# Altium project EPS_V1.PrjPcb
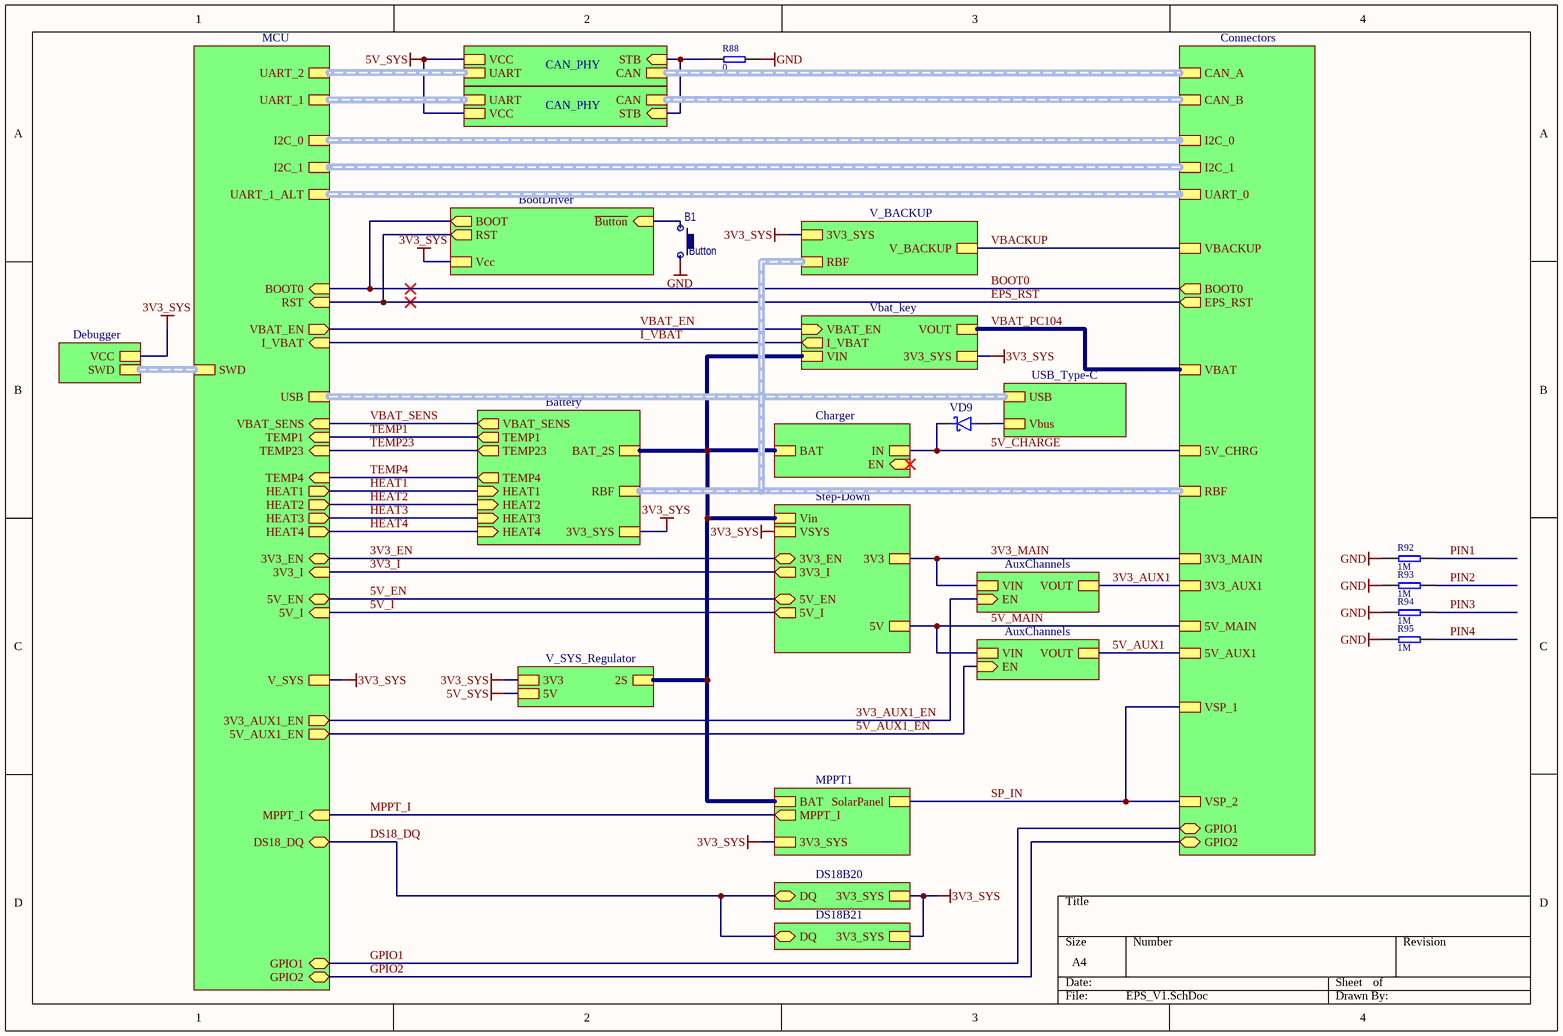
[diagram p0: EPS_V1.SchDoc]
21 sheets, 311 parts. Net scope: hierarchical (ports join the sheet entries above them; power ports are global).
Board file: EPS_V1.PcbDoc
Sheets:
  EPS_V1.SchDoc
    Battery = Battery.SchDoc
      Balancer = Balancer.SchDoc
      BAT3 = BMS.SchDoc
      BAT2 = BMS.SchDoc
      BAT4 = BMS.SchDoc
      BAT1 = BMS.SchDoc
      Balancer = Balancer.SchDoc
      Timer = Timer.SchDoc
    Step-Down = DC-step-down.SchDoc
      OverCurrent_Protection_1 = OverCurrent_Protection.SchDoc
      OverCurrent_Protection_2 = OverCurrent_Protection.SchDoc
    MPPT1 = MPPT.SchDoc
      ShuntAmp = ShuntAmp.SchDoc
    USB_Type-C = USB_Type-C.SchDoc
    Charger = Charger.SchDoc
    MCU = MCU.SchDoc
    Connectors = Connectors.SchDoc
    CAN_PHY = CAN_PHY.SchDoc
    CAN_PHY = CAN_PHY.SchDoc
    V_SYS_Regulator = V_SYS_Regulator.SchDoc
    Vbat_key = Vbat_key.SchDoc
      OverCurrent_Protection_3 = OverCurrent_Protection.SchDoc
    AuxChannels = AuxChannels.SchDoc
    AuxChannels = AuxChannels.SchDoc
    V_BACKUP = V_BACKUP.SchDoc
    DS18B20 = DS18B20.SchDoc
    DS18B21 = DS18B20.SchDoc
    BootDriver = BootDriver.SchDoc
    Debugger = Debugger.SchDoc

## Sheet EPS_V1.SchDoc
size A4; SheetNumber: 1; SheetTotal: 21

### Parts
B1  Button  [button]
R88  value 0  [RES 0402]
R92  value 1M  [RES 0402]
R93  value 1M  [RES 0402]
R94  value 1M  [RES 0402]
R95  value 1M  [RES 0402]
VD9  (no value)  [SOD-123]

### Sub-sheets
AuxChannels = AuxChannels.SchDoc: VIN, VOUT, EN (in)
AuxChannels = AuxChannels.SchDoc: VIN, VOUT, EN (in)
Battery = Battery.SchDoc: BAT_2S, VBAT_SENS (out), HEAT2 (in), 3V3_SYS, RBF (harness RBF), HEAT4 (in), TEMP23 (out), TEMP4 (out), HEAT3 (in), TEMP1 (out), HEAT1 (in)
BootDriver = BootDriver.SchDoc: ~{Button} (in), RST (out), BOOT (out), Vcc
CAN_PHY = CAN_PHY.SchDoc: VCC, STB (in), CAN (harness CAN), UART (harness UART)
CAN_PHY = CAN_PHY.SchDoc: VCC, STB (in), CAN (harness CAN), UART (harness UART)
Charger = Charger.SchDoc: BAT, IN, EN (in)
Connectors = Connectors.SchDoc: VSP_2, VSP_1, BOOT0 (out), EPS_RST (out), 5V_MAIN, VBAT, 3V3_MAIN, VBACKUP, I2C_1 (harness I2C), UART_0 (harness UART), I2C_0 (harness I2C), CAN_A (harness CAN), CAN_B (harness CAN), 5V_CHRG, RBF (harness RBF), 3V3_AUX1, 5V_AUX1, GPIO1 (bidir), GPIO2 (bidir)
Debugger = Debugger.SchDoc: SWD (harness SWD), VCC
DS18B20 = DS18B20.SchDoc: DQ (bidir), 3V3_SYS
DS18B21 = DS18B20.SchDoc: DQ (bidir), 3V3_SYS
MCU = MCU.SchDoc: SWD (harness SWD), BOOT0 (in), RST (in), 3V3_I (in), 5V_I (in), 3V3_EN (bidir), 5V_EN (bidir), VBAT_SENS (in), UART_2 (harness UART), I2C_1 (harness I2C), UART_1 (harness UART), I2C_0 (harness I2C), V_SYS, USB (harness USB), UART_1_ALT (harness UART), TEMP1 (in), TEMP23 (in), TEMP4 (in), HEAT1 (out), HEAT2 (out), HEAT3 (out), HEAT4 (out), VBAT_EN (out), I_VBAT (in), 3V3_AUX1_EN (out), 5V_AUX1_EN (out), MPPT_I (in), DS18_DQ (bidir), GPIO1 (bidir), GPIO2 (bidir)
MPPT1 = MPPT.SchDoc: SolarPanel, BAT, 3V3_SYS, MPPT_I (out)
Step-Down = DC-step-down.SchDoc: Vin, 3V3_EN (bidir), 3V3_I (out), VSYS, 3V3, 5V_I (out), 5V_EN (bidir), 5V
USB_Type-C = USB_Type-C.SchDoc: USB (harness USB), Vbus
V_BACKUP = V_BACKUP.SchDoc: V_BACKUP, RBF (harness RBF), 3V3_SYS
V_SYS_Regulator = V_SYS_Regulator.SchDoc: 2S, 3V3, 5V
Vbat_key = Vbat_key.SchDoc: VIN, VBAT_EN (in), VOUT, I_VBAT (out), 3V3_SYS

### Nets
3V3_SYS: sheet Battery/3V3_SYS, sheet Step-Down/VSYS, sheet MPPT1/3V3_SYS, sheet MCU/V_SYS, sheet V_SYS_Regulator/3V3, sheet Vbat_key/3V3_SYS, sheet V_BACKUP/3V3_SYS, sheet DS18B20/3V3_SYS, sheet DS18B21/3V3_SYS, sheet BootDriver/Vcc, sheet Debugger/VCC
5V_SYS: sheet CAN_PHY/VCC, sheet CAN_PHY/VCC, sheet V_SYS_Regulator/5V
BAT_2S: sheet Battery/BAT_2S, sheet Step-Down/Vin, sheet MPPT1/BAT, sheet Charger/BAT, sheet V_SYS_Regulator/2S, sheet Vbat_key/VIN
GND: B1.1 R88.2 R92.1 R93.1 R94.1 R95.1
3V3_AUX1: sheet Connectors/3V3_AUX1, sheet AuxChannels/VOUT
3V3_AUX1_EN: sheet MCU/3V3_AUX1_EN, sheet AuxChannels/EN
3V3_EN: sheet Step-Down/3V3_EN, sheet MCU/3V3_EN
3V3_I: sheet Step-Down/3V3_I, sheet MCU/3V3_I
3V3_MAIN: sheet Step-Down/3V3, sheet Connectors/3V3_MAIN, sheet AuxChannels/VIN
5V_AUX1: sheet Connectors/5V_AUX1, sheet AuxChannels/VOUT
5V_AUX1_EN: sheet MCU/5V_AUX1_EN, sheet AuxChannels/EN
5V_CHARGE: VD9.C(Cathode) ; sheet Charger/IN, sheet Connectors/5V_CHRG
5V_EN: sheet Step-Down/5V_EN, sheet MCU/5V_EN
5V_I: sheet Step-Down/5V_I, sheet MCU/5V_I
5V_MAIN: sheet Step-Down/5V, sheet Connectors/5V_MAIN, sheet AuxChannels/VIN
BOOT0: sheet MCU/BOOT0, sheet Connectors/BOOT0, sheet BootDriver/BOOT
DS18_DQ: sheet MCU/DS18_DQ, sheet DS18B20/DQ, sheet DS18B21/DQ
EPS_RST: sheet MCU/RST, sheet Connectors/EPS_RST, sheet BootDriver/RST
GPIO1: sheet MCU/GPIO1, sheet Connectors/GPIO1
GPIO2: sheet MCU/GPIO2, sheet Connectors/GPIO2
HEAT1: sheet Battery/HEAT1, sheet MCU/HEAT1
HEAT2: sheet Battery/HEAT2, sheet MCU/HEAT2
HEAT3: sheet Battery/HEAT3, sheet MCU/HEAT3
HEAT4: sheet Battery/HEAT4, sheet MCU/HEAT4
I_VBAT: sheet MCU/I_VBAT, sheet Vbat_key/I_VBAT
MPPT_I: sheet MPPT1/MPPT_I, sheet MCU/MPPT_I
PIN1: R92.2
PIN2: R93.2
PIN3: R94.2
PIN4: R95.2
SP_IN: sheet MPPT1/SolarPanel, sheet Connectors/VSP_2, sheet Connectors/VSP_1
TEMP1: sheet Battery/TEMP1, sheet MCU/TEMP1
TEMP4: sheet Battery/TEMP4, sheet MCU/TEMP4
TEMP23: sheet Battery/TEMP23, sheet MCU/TEMP23
VBACKUP: sheet Connectors/VBACKUP, sheet V_BACKUP/V_BACKUP
VBAT_EN: sheet MCU/VBAT_EN, sheet Vbat_key/VBAT_EN
VBAT_PC104: sheet Connectors/VBAT, sheet Vbat_key/VOUT
VBAT_SENS: sheet Battery/VBAT_SENS, sheet MCU/VBAT_SENS
NetB1_2: B1.2 ; sheet BootDriver/~{Button}
NetR88_1: R88.1 ; sheet CAN_PHY/STB, sheet CAN_PHY/STB
NetUSB1_A4B9: VD9.A(Anode) ; sheet USB_Type-C/Vbus

### Buses and harness runs
harness sheet Battery/RBF = sheet Connectors/RBF = sheet V_BACKUP/RBF
harness sheet CAN_PHY/CAN = sheet Connectors/CAN_A
harness sheet CAN_PHY/CAN = sheet Connectors/CAN_B
harness sheet CAN_PHY/UART = sheet MCU/UART_1
harness sheet CAN_PHY/UART = sheet MCU/UART_2
harness sheet Connectors/I2C_0 = sheet MCU/I2C_0
harness sheet Connectors/I2C_1 = sheet MCU/I2C_1
harness sheet Connectors/UART_0 = sheet MCU/UART_1_ALT
harness sheet Debugger/SWD = sheet MCU/SWD
harness sheet MCU/USB = sheet USB_Type-C/USB

### Library data of the parts
R88 R92-R95 = !Resistor: Resistor; IsSMT: NoSMT
VD9 = DiodeS: Diode Shottky; IsSMT: NoSMT

## Sheet Battery.SchDoc
size A4; SheetNumber: 2; SheetTotal: 21
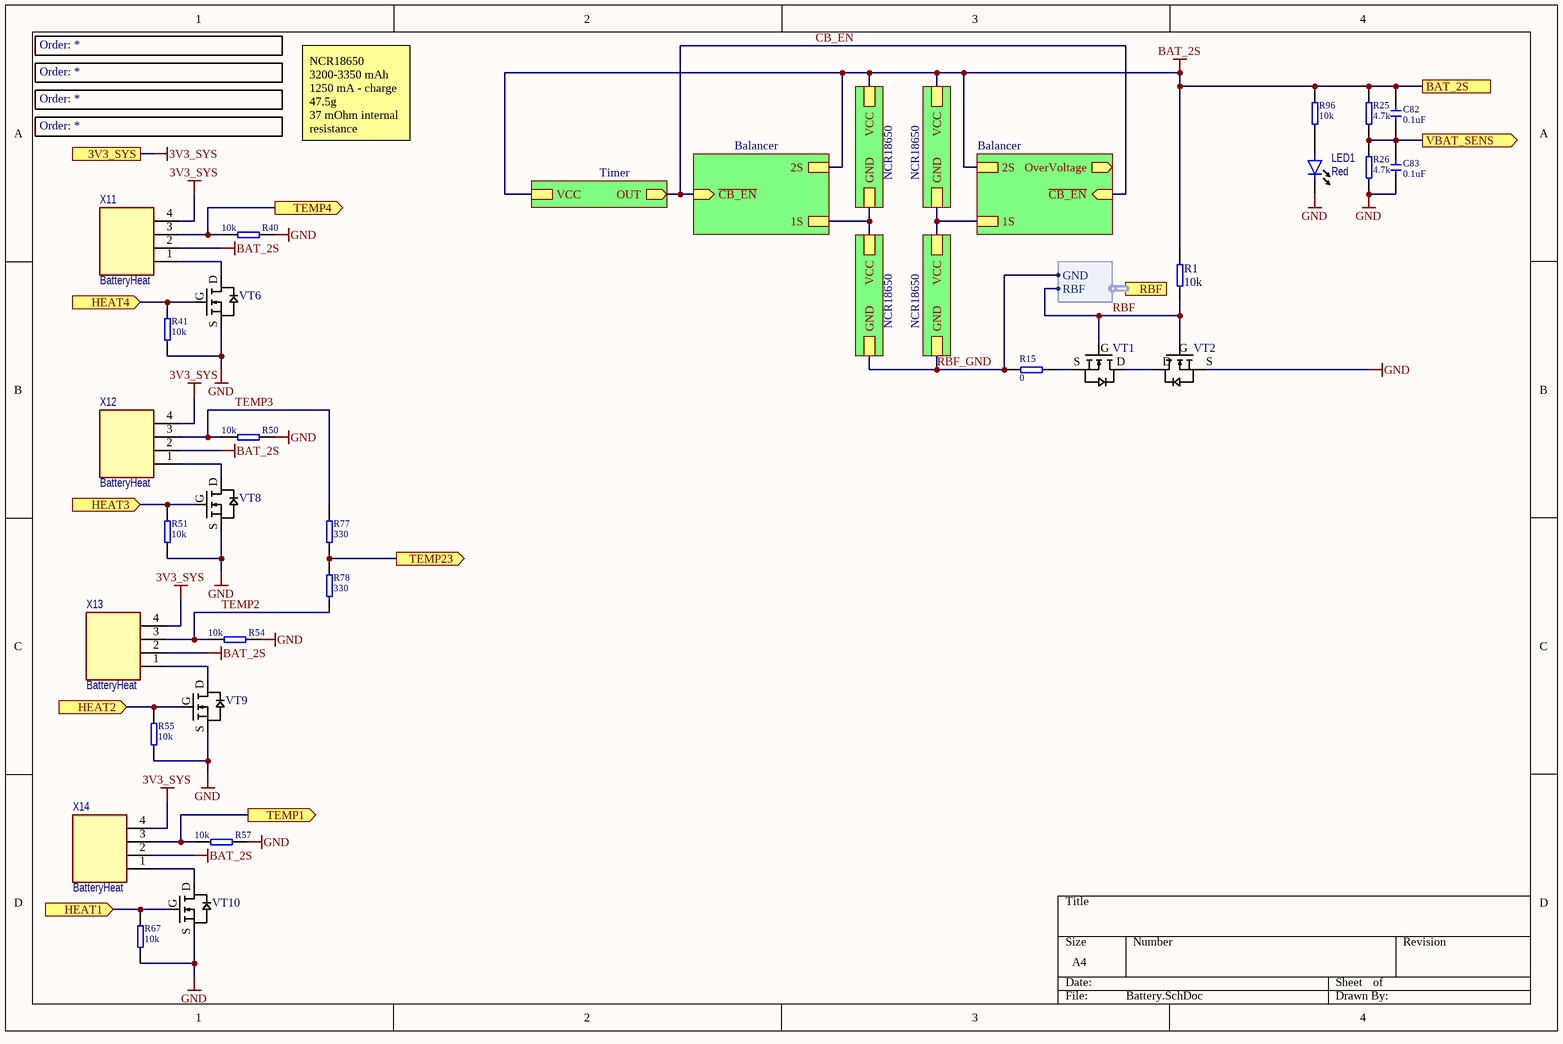
[diagram p1: Battery.SchDoc]

### Parts
Additional_order1  *  (mechanical)
Additional_order2  *  (mechanical)
Additional_order3  *  (mechanical)
Additional_order4  *  (mechanical)
C82  value 0.1uF  [CERCAP 0402]
C83  value 0.1uF  [CERCAP 0402]
LED1  value Red  [LED 0603]
R1  value 10k  [RES 0402]
R15  value 0  [RES 0805]
R25  value 4.7k  [RES 0402]
R26  value 4.7k  [RES 0402]
R40  value 10k  [RES 0402]
R41  value 10k  [RES 0402]
R50  value 10k  [RES 0402]
R51  value 10k  [RES 0402]
R54  value 10k  [RES 0402]
R55  value 10k  [RES 0402]
R57  value 10k  [RES 0402]
R67  value 10k  [RES 0402]
R77  value 330  [RES 0402]
R78  value 330  [RES 0402]
R96  value 10k  [RES 0402]
VT1  NTMFS5C670NLT1G  [DFN-8_3x3]  (value not drawn)
VT2  NTMFS5C670NLT1G  [DFN-8_3x3]  (value not drawn)
VT6  2N7002  [SOT23-3]  (value not drawn)
VT8  2N7002  [SOT23-3]  (value not drawn)
VT9  2N7002  [SOT23-3]  (value not drawn)
VT10  2N7002  [SOT23-3]  (value not drawn)
X11  Purpose: BatteryHeat  [PicoBlade_4P]  (hidden comment: 0533980471)
X12  Purpose: BatteryHeat  [PicoBlade_4P]  (hidden comment: 0533980471)
X13  Purpose: BatteryHeat  [PicoBlade_4P]  (hidden comment: 0533980471)
X14  Purpose: BatteryHeat  [PicoBlade_4P]  (hidden comment: 0533980471)

### Sub-sheets
Balancer = Balancer.SchDoc: 2S, ~{CB_EN} (in), 1S
Balancer = Balancer.SchDoc: OverVoltage (out), 2S, ~{CB_EN} (in), 1S
BAT1 = BMS.SchDoc: VCC, GND
BAT2 = BMS.SchDoc: VCC, GND
BAT3 = BMS.SchDoc: VCC, GND
BAT4 = BMS.SchDoc: VCC, GND
Timer = Timer.SchDoc: OUT (out), VCC

### Ports
3V3_SYS, BAT_2S, HEAT1 (in), HEAT2 (in), HEAT3 (in), HEAT4 (in), RBF (harness RBF), TEMP1 (out), TEMP4 (out), TEMP23 (out), VBAT_SENS (out)

### Harnesses
RBF: GND, RBF

### Nets
3V3_SYS: X11.4 X12.4 X13.4 X14.4 ; port 3V3_SYS
BAT_2S: C82.2 R1.2 R25.2 R96.2 X11.2 X12.2 X13.2 X14.2 ; port BAT_2S, sheet Balancer/2S, sheet BAT2/VCC, sheet BAT1/VCC, sheet Balancer/2S, sheet Timer/VCC
GND: C83.1 LED1.2(Cathode) R26.1 R40.2 R41.1 R50.2 R51.1 R54.2 R55.1 R57.2 R67.1 VT2.S1 VT6.S1 VT8.S1 VT9.S1 VT10.S1
CB_EN: sheet Balancer/~{CB_EN}, sheet Balancer/~{CB_EN}, sheet Timer/OUT
HEAT1: R67.2 VT10.G2 ; port HEAT1
HEAT2: R55.2 VT9.G2 ; port HEAT2
HEAT3: R51.2 VT8.G2 ; port HEAT3
HEAT4: R41.2 VT6.G2 ; port HEAT4
RBF: R1.1 VT1.G2 VT2.G2 ; port RBF.RBF
RBF_GND: R15.1 ; sheet BAT3/GND, sheet BAT4/GND, port RBF.GND
TEMP1: R57.1 X14.3 ; port TEMP1
TEMP2: R54.1 R78.1 X13.3
TEMP3: R50.1 R77.2 X12.3
TEMP4: R40.1 X11.3 ; port TEMP4
TEMP23: R77.1 R78.2 ; port TEMP23
VBAT_SENS: C82.1 C83.2 R25.1 R26.2 ; port VBAT_SENS
NetBAT1_BAT3_A: sheet Balancer/1S, sheet BAT3/VCC, sheet BAT1/GND
NetBAT1_BAT4_A: sheet BAT2/GND, sheet BAT4/VCC, sheet Balancer/1S
NetLED1_1: LED1.1(Anode) R96.1
NetR15_2: R15.2 VT1.S1
NetVT1_D6: VT1.D6 VT2.D6
NetVT6_D6: VT6.D6 X11.1
NetVT8_D6: VT8.D6 X12.1
NetVT9_D6: VT9.D6 X13.1
NetVT10_D6: VT10.D6 X14.1

### Notes on the sheet
- NCR18650
  3200-3350 mAh
  1250 mA - charge
  47.5g
  37 mOhm internal resistance
- NCR18650
- (in symbol !Generic N MOSFET) G; S; D

### Library data of the parts
Additional_order1-Additional_order4 = Additional_Order: Order: *
C82 C83 = !Capacitor: Capacitor; IsSMT: NoSMT; Voltage: 50V; Diel: X7R
LED1 = LED: Light Emittering Diode; IsSMT: NoSMT
R1 R15 R25 R26 R40 R41 R50 R51 R54 R55 R57 R67 R77 R78 R96 = !Resistor: Resistor; IsSMT: NoSMT
VT1 VT2 = !Generic N MOSFET: generic N mosfet; pin to pad: D6>5+6+7+8+TH G2>4 S1>1+2+3; IsSMT: NoSMT
VT6 VT8-VT10 = !Generic N MOSFET: generic N mosfet; pin to pad: D6>3 G2>1 S1>2; IsSMT: NoSMT
X11-X14 = Header 1x4: 4x1 header; IsSMT: NoSMT

## Sheet Balancer.SchDoc
size A4; SheetNumber: 4; SheetTotal: 21
Used 2 times, as channels Battery/Balancer, Battery/Balancer. Parts and nets are listed once, with the designators drawn on the sheet.
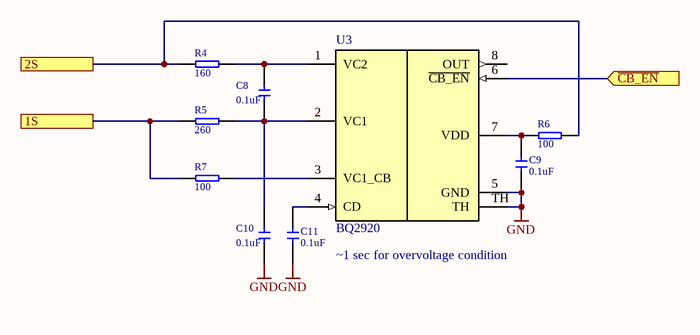
[diagram p2: Balancer.SchDoc]

### Parts
C8  value 0.1uF  [CERCAP 0402]
C9  value 0.1uF  [CERCAP 0402]
C10  value 0.1uF  [CERCAP 0402]
C11  value 0.1uF  [CERCAP 0402]
R4  value 160  [RES 0603]
R5  value 260  [RES 0603]
R6  value 100  [RES 0402]
R7  value 100  [RES 0603]
U3  BQ2920  [VSON-8]

### Ports
1S, 2S, ~{CB_EN} (in)

### Nets
GND: C9.1 C10.1 C11.1 U3.5(GND) U3.TH
1S: R5.1 R7.1 ; port 1S
2S: R4.1 R6.2 ; port 2S
~{CB_EN}: U3.6(~{CB_EN}) ; port ~{CB_EN}
NetC8_1: C8.1 C10.2 R5.2 U3.2(VC1)
NetC8_2: C8.2 R4.2 U3.1(VC2)
NetC9_2: C9.2 R6.1 U3.7(VDD)
NetC11_2: C11.2 U3.4(CD)
NetR7_2: R7.2 U3.3(VC1_CB)

Not connected (* = marked no-connect by the designer): U3 8(OUT)

### Channels
Battery/Balancer: designators end in _Battery_Balancer#1; ports 1S=NetBAT1_BAT3_A 2S=BAT_2S ~{CB_EN}=CB_EN
Battery/Balancer: designators end in _Battery_Balancer#2; ports 1S=NetBAT1_BAT4_A 2S=BAT_2S ~{CB_EN}=CB_EN

### Notes on the sheet
- ~1 sec for overvoltage condition

### Library data of the parts
C8-C11 = !Capacitor: as C82 on sheet Battery
R4-R7 = !Resistor: Resistor; IsSMT: NoSMT
U3 = BQ2920: 2S li-ion balancer

## Sheet BMS.SchDoc
size A4; SheetNumber: 3; SheetTotal: 21
Used 4 times, as channels Battery/BAT3, Battery/BAT2, Battery/BAT4, Battery/BAT1. Parts and nets are listed once, with the designators drawn on the sheet.
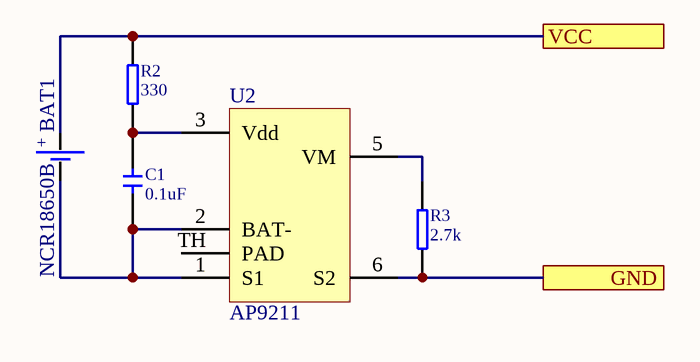
[diagram p3: BMS.SchDoc]

### Parts
BAT1  NCR18650B  [BAT_18650_CLIPS]
C1  value 0.1uF  [CERCAP 0402]
R2  value 330  [RES 0402]
R3  value 2.7k  [RES 0402]
U2  AP9211  [DFN-8-2x3]

### Ports
GND, VCC

### Nets
GND: R3.1 U2.6(S2) ; port GND
VCC: BAT1.A R2.2 ; port VCC
NetBAT1_K: BAT1.K C1.1 U2.1(S1) U2.2(BAT-)
NetC1_2: C1.2 R2.1 U2.3(Vdd)
NetR3_2: R3.2 U2.5(VM)

Not connected (* = marked no-connect by the designer): U2 TH(PAD)

### Channels
Battery/BAT3: designators end in _BAT3; ports GND=RBF_GND VCC=NetBAT1_BAT3_A
Battery/BAT2: designators end in _BAT2; ports GND=NetBAT1_BAT4_A VCC=BAT_2S
Battery/BAT4: designators end in _BAT4; ports GND=RBF_GND VCC=NetBAT1_BAT4_A
Battery/BAT1: designators end in _BAT1; ports GND=NetBAT1_BAT3_A VCC=BAT_2S

### Notes on the sheet
- (in symbol !Battery) +

### Library data of the parts
BAT1 = !Battery: generic battery
C1 = !Capacitor: as C82 on sheet Battery
R2 R3 = !Resistor: Resistor; IsSMT: NoSMT
U2 = AP9211: BMS with built-in keys; IsSMT: NoSMT; Order: *; LCSC Part #: *; BuyLink1: *

## Sheet Timer.SchDoc
size A4; SheetNumber: 5; SheetTotal: 21
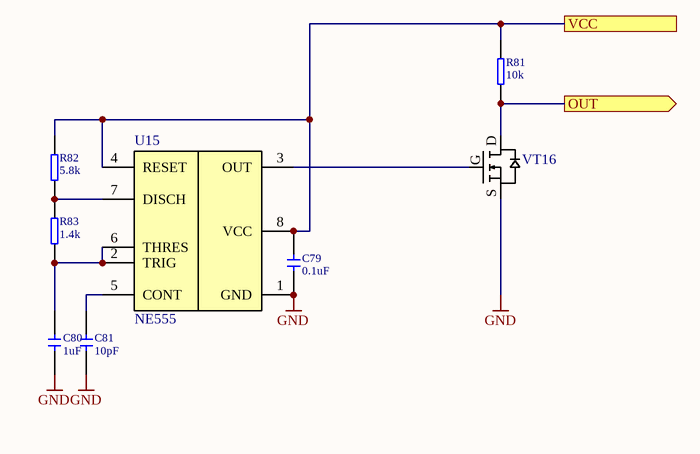
[diagram p4: Timer.SchDoc]

### Parts
C79  value 0.1uF  [CERCAP 0402]
C80  value 1uF  [CERCAP 0603]
C81  value 10pF  [CERCAP 0402]
R81  value 10k  [RES 0402]
R82  value 5.8k  [RES 0402]
R83  value 1.4k  [RES 0402]
U15  NE555  [SO-8]
VT16  2N7002  [SOT23-3]  (value not drawn)

### Ports
OUT (out), VCC

### Nets
BAT_2S: C79.2 R81.2 R82.2 U15.4(RESET) U15.8(VCC) ; port VCC
GND: C79.1 C80.1 C81.1 U15.1(GND) VT16.S1
CB_EN: R81.1 VT16.D6 ; port OUT
NetC80_2: C80.2 R83.1 U15.2(TRIG) U15.6(THRES)
NetC81_2: C81.2 U15.5(CONT)
NetR82_1: R82.1 R83.2 U15.7(DISCH)
NetU15_3: U15.3(OUT) VT16.G2

### Notes on the sheet
- (in symbol !Generic N MOSFET) D; G; S

### Library data of the parts
C79-C81 = !Capacitor: as C82 on sheet Battery
R81-R83 = !Resistor: Resistor; IsSMT: NoSMT
U15 = NE555: 555 timer
VT16 = !Generic N MOSFET: generic N mosfet; pin to pad: D6>3 G2>1 S1>2; IsSMT: NoSMT

## Sheet DC-step-down.SchDoc
size A4; SheetNumber: 7; SheetTotal: 21
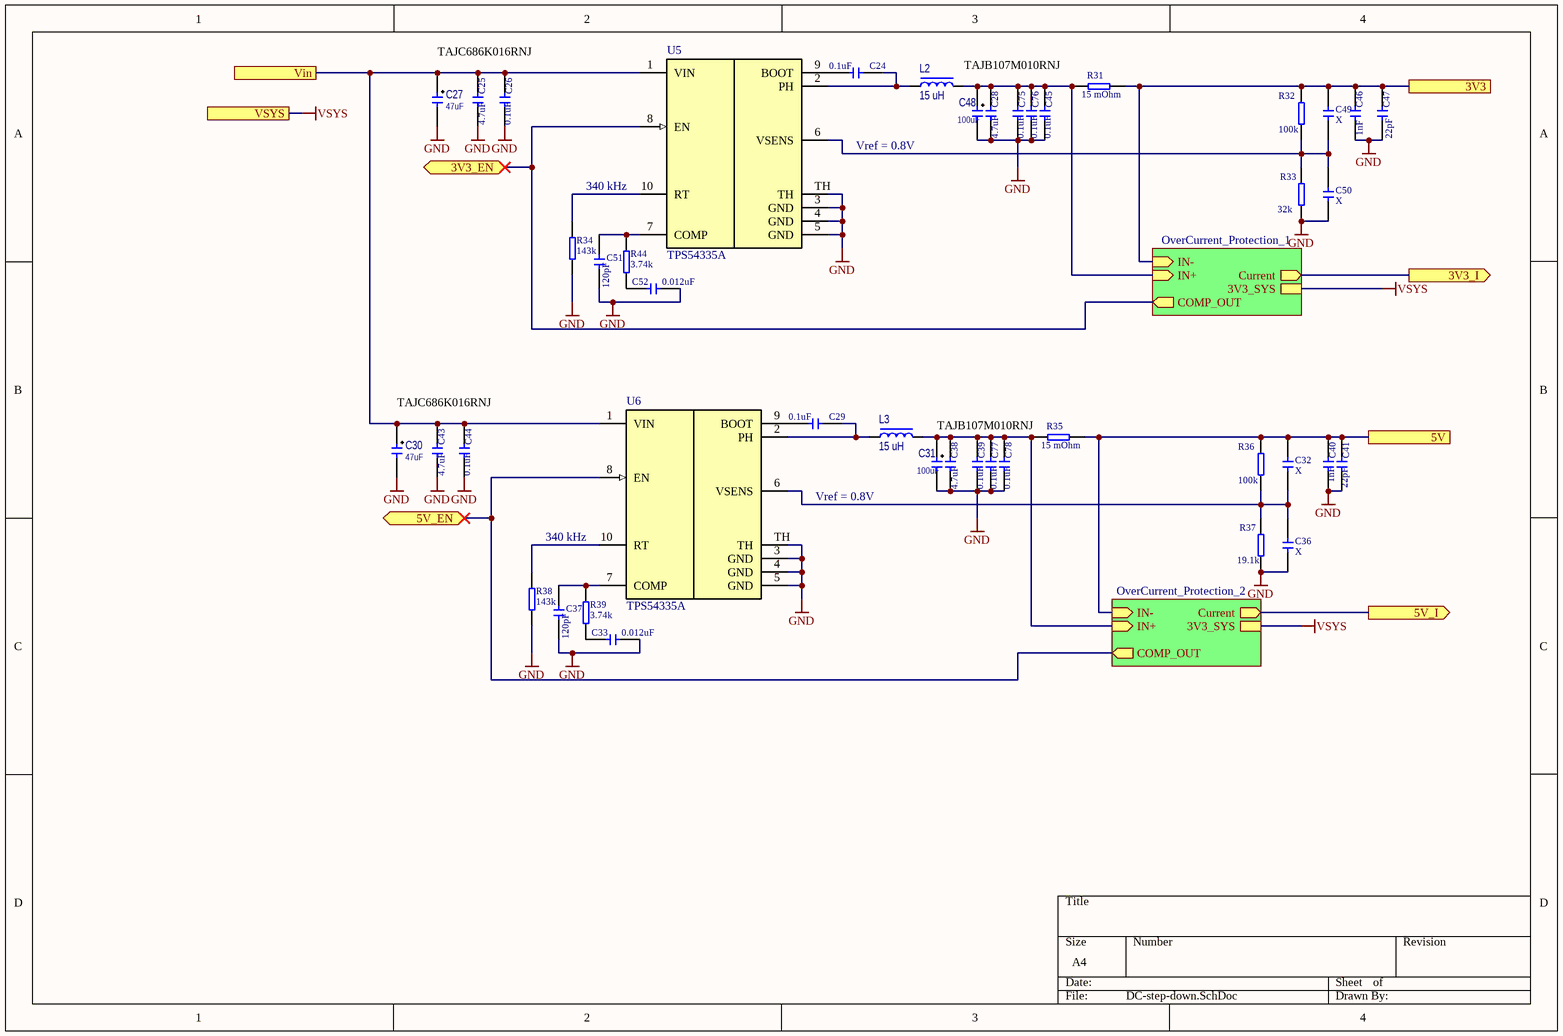
[diagram p5: DC-step-down.SchDoc]

### Parts
C24  value 0.1uF  [CERCAP 0402]
C25  value 4.7uF  [CERCAP 0603]
C26  value 0.1uF  [CERCAP 0402]
C27  value 47uF  [TECAP B]  (hidden comment: TAJC686K016RNJ)
C28  value 4.7uF  [CERCAP 0603]
C29  value 0.1uF  [CERCAP 0402]
C30  value 47uF  [TECAP B]  (hidden comment: TAJC686K016RNJ)
C31  value 100uF  [TECAP B]  (hidden comment: TAJB107M010RNJ)
C32  value X  [CERCAP 0402]  (no BOM)
C33  value 0.012uF  [CERCAP 0402]
C36  value X  [CERCAP 0402]  (no BOM)
C37  value 120pF  [CERCAP 0402]
C38  value 4.7uF  [CERCAP 0603]
C39  value 0.1uF  [CERCAP 0402]
C40  value 1nF  [CERCAP 0402]
C41  value 22pF  [CERCAP 0402]
C43  value 4.7uF  [CERCAP 0603]
C44  value 0.1uF  [CERCAP 0402]
C45  value 0.1uF  [CERCAP 0402]
C46  value 1nF  [CERCAP 0402]
C47  value 22pF  [CERCAP 0402]
C48  value 100uF  [TECAP B]  (hidden comment: TAJB107M010RNJ)
C49  value X  [CERCAP 0402]  (no BOM)
C50  value X  [CERCAP 0402]  (no BOM)
C51  value 120pF  [CERCAP 0402]
C52  value 0.012uF  [CERCAP 0402]
C75  value 0.1uF  [CERCAP 0402]
C76  value 0.1uF  [CERCAP 0402]
C77  value 0.1uF  [CERCAP 0402]
C78  value 0.1uF  [CERCAP 0402]
L2  value 15 uH  [IND-5x5]  (hidden comment: IND-5x5 15 uH)
L3  value 15 uH  [IND-5x5]  (hidden comment: IND-5x5 15 uH)
R31  value 15 mOhm  [RES 1210]
R32  value 100k  [RES 0402]
R33  value 32k  [RES 0402]
R34  value 143k  [RES 0402]
R35  value 15 mOhm  [RES 1210]
R36  value 100k  [RES 0402]
R37  value 19.1k  [RES 0402]
R38  value 143k  [RES 0402]
R39  value 3.74k  [RES 0402]
R44  value 3.74k  [RES 0402]
U5  TPS54335A  [VSON-10]
U6  TPS54335A  [VSON-10]

### Sub-sheets
OverCurrent_Protection_1 = OverCurrent_Protection.SchDoc: IN- (in), IN+ (in), Current (out), COMP_OUT (out), 3V3_SYS
OverCurrent_Protection_2 = OverCurrent_Protection.SchDoc: IN- (in), IN+ (in), Current (out), COMP_OUT (out), 3V3_SYS

### Ports
3V3, 3V3_EN (bidir), 3V3_I (out), 5V, 5V_EN (bidir), 5V_I (out), Vin, VSYS

### Nets
BAT_2S: C25.2 C26.2 C27.1(+) C30.1(+) C43.2 C44.2 U5.1(VIN) U6.1(VIN) ; port Vin
GND: C25.1 C26.1 C27.2(-) C28.1 C30.2(-) C31.2(-) C33.1 C36.1 C37.2 C38.1 C39.1 C40.1 C41.1 C43.1 C44.1 C45.1 C46.1 C47.1 C48.2(-) C50.1 C51.2 C52.1 C75.1 C76.1 C77.1 C78.1 R33.1 R34.1 R37.1 R38.1 U5.3(GND) U5.4(GND) U5.5(GND) U5.TH U6.3(GND) U6.4(GND) U6.5(GND) U6.TH
VSYS: port VSYS, sheet OverCurrent_Protection_1/3V3_SYS, sheet OverCurrent_Protection_2/3V3_SYS  [project net 3V3_SYS]
3V3_EN: U5.8(EN) ; port 3V3_EN, sheet OverCurrent_Protection_1/COMP_OUT
3V3_I: port 3V3_I, sheet OverCurrent_Protection_1/Current
3V3_MAIN: C46.2 C47.2 C49.2 R31.2 R32.2 ; port 3V3, sheet OverCurrent_Protection_1/IN-
5V_EN: U6.8(EN) ; port 5V_EN, sheet OverCurrent_Protection_2/COMP_OUT
5V_I: port 5V_I, sheet OverCurrent_Protection_2/Current
5V_MAIN: C32.2 C40.2 C41.2 R35.2 R36.2 ; port 5V, sheet OverCurrent_Protection_2/IN-
NetC24_1: C24.1 U5.9(BOOT)
NetC24_2: C24.2 L2.1 U5.2(PH)
NetC28_2: C28.2 C45.2 C48.1(+) C75.2 C76.2 L2.2 R31.1 ; sheet OverCurrent_Protection_1/IN+
NetC29_1: C29.1 U6.9(BOOT)
NetC29_2: C29.2 L3.1 U6.2(PH)
NetC31_1: C31.1(+) C38.2 C39.2 C77.2 C78.2 L3.2 R35.1 ; sheet OverCurrent_Protection_2/IN+
NetC32_1: C32.1 C36.2 R36.1 R37.2 U6.6(VSENS)
NetC33_2: C33.2 R39.1
NetC37_1: C37.1 R39.2 U6.7(COMP)
NetC49_1: C49.1 C50.2 R32.1 R33.2 U5.6(VSENS)
NetC51_1: C51.1 R44.2 U5.7(COMP)
NetC52_2: C52.2 R44.1
NetR34_2: R34.2 U5.10(RT)
NetR38_2: R38.2 U6.10(RT)

### Notes on the sheet
- TAJC686K016RNJ
- TAJB107M010RNJ
- Vref = 0.8V
- 340 kHz
- (near R35) TAJB107M010RNJ

### Library data of the parts
C24 C26 C29 C32 C33 C36 C37 C39-C41 C44-C47 C49-C52 C75-C78 = !Capacitor: as C82 on sheet Battery
C25 C43 = !Capacitor: Capacitor; IsSMT: NoSMT; Voltage: 16V; Diel: X7R
C27 C30 C31 C48 = CapacitorP: Capacitor Polar; IsSMT: NoSMT; Diel: X7R; Voltage: *
C28 C38 = !Capacitor: Capacitor; IsSMT: NoSMT; Voltage: 10V; Diel: X7R
L2 L3 = Inductor: IsSMT: NoSMT
R31-R39 R44 = !Resistor: Resistor; IsSMT: NoSMT
U5 U6 = TPS54335A: buck sync wEN woPG

## Sheet OverCurrent_Protection.SchDoc
size A4; SheetNumber: 8; SheetTotal: 21
Used 3 times, as channels Step-Down/OverCurrent_Protection_1, Step-Down/OverCurrent_Protection_2, Vbat_key/OverCurrent_Protection_3. Parts and nets are listed once, with the designators drawn on the sheet.
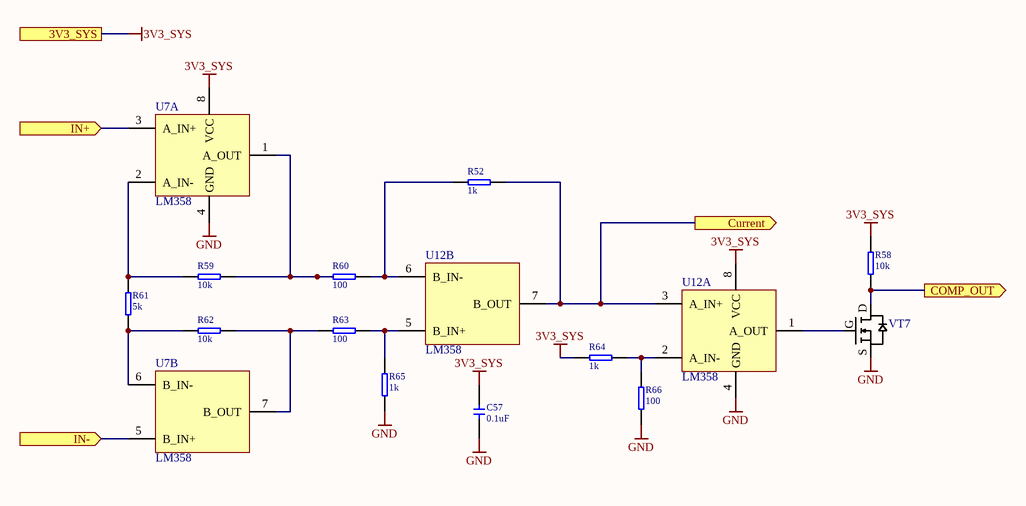
[diagram p6: OverCurrent_Protection.SchDoc]

### Parts
C57  value 0.1uF  [CERCAP 0402]
R52  value 1k  [RES 0402]
R58  value 10k  [RES 0402]
R59  value 10k  [RES 0402]
R60  value 100  [RES 0402]
R61  value 5k  [RES 0402]
R62  value 10k  [RES 0402]
R63  value 100  [RES 0402]
R64  value 1k  [RES 0402]
R65  value 1k  [RES 0402]
R66  value 100  [RES 0402]
U7  LM358  [DFN-8-2x2]  (parts A,B of 2)
U12  LM358  [DFN-8-2x2]  (parts A,B of 2)
VT7  2N7002  [SOT23-3]  (value not drawn)

### Ports
3V3_SYS, COMP_OUT (out), Current (out), IN+ (in), IN- (in)

### Nets
3V3_SYS: C57.2 R58.2 R64.2 U7.8(VCC) U12.8(VCC) ; port 3V3_SYS
GND: C57.1 R65.1 R66.2 U7.4(GND) U12.4(GND) VT7.S1
COMP_OUT: R58.1 VT7.D6 ; port COMP_OUT
Current: R52.1 U12.3(A_IN+) U12.7(B_OUT) ; port Current
IN+: U7.3(A_IN+) ; port IN+
IN-: U7.5(B_IN+) ; port IN-
NetR52_2: R52.2 R60.2 U12.6(B_IN-)
NetR59_1: R59.1 R61.2 U7.2(A_IN-)
NetR59_2: R59.2 R60.1 U7.1(A_OUT)
NetR61_1: R61.1 R62.1 U7.6(B_IN-)
NetR62_2: R62.2 R63.1 U7.7(B_OUT)
NetR63_2: R63.2 R65.2 U12.5(B_IN+)
NetR64_1: R64.1 R66.1 U12.2(A_IN-)
NetU12_1: U12.1(A_OUT) VT7.G2

### Channels
Step-Down/OverCurrent_Protection_1: designators end in _OverCurrent_Protection_1; ports 3V3_SYS=3V3_SYS COMP_OUT=3V3_EN Current=3V3_I IN+=NetC28_2 IN-=3V3_MAIN
Step-Down/OverCurrent_Protection_2: designators end in _OverCurrent_Protection_2; ports 3V3_SYS=3V3_SYS COMP_OUT=5V_EN Current=5V_I IN+=NetC31_1 IN-=5V_MAIN
Vbat_key/OverCurrent_Protection_3: designators end in _OverCurrent_Protection_3; ports 3V3_SYS=3V3_SYS COMP_OUT=VBAT_EN Current=I_VBAT IN+=NetR10_1 IN-=VBAT_PC104

### Notes on the sheet
- (in symbol !Generic N MOSFET) D; G; S

### Library data of the parts
C57 = !Capacitor: as C82 on sheet Battery
R52 R58-R66 = !Resistor: Resistor; IsSMT: NoSMT
U7 U12 = DualOpAmp: Operational amplifier
VT7 = !Generic N MOSFET: generic N mosfet; pin to pad: D6>3 G2>1 S1>2; IsSMT: NoSMT

## Sheet MPPT.SchDoc
size A4; SheetNumber: 9; SheetTotal: 21
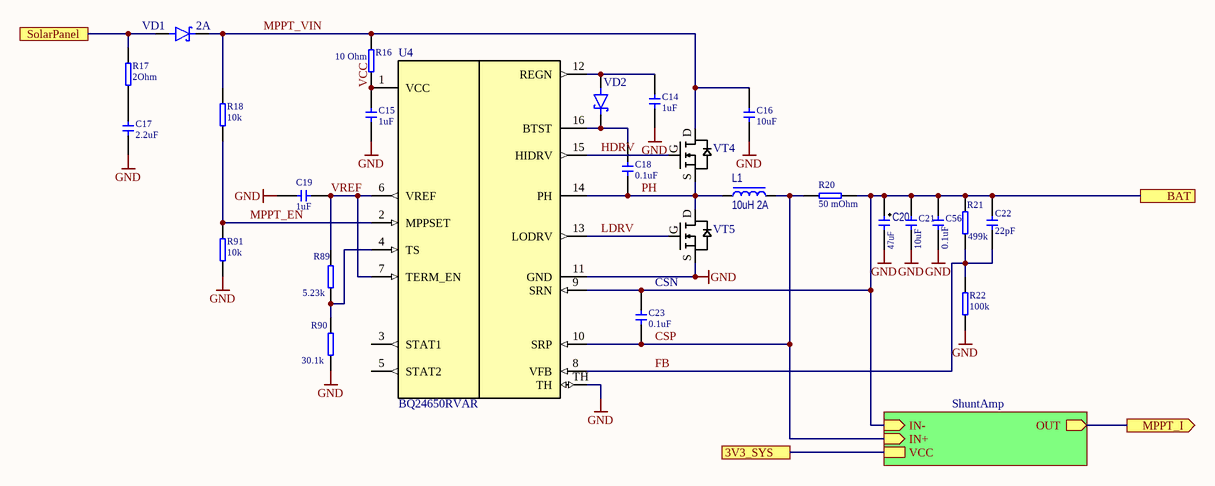
[diagram p7: MPPT.SchDoc]

### Parts
C14  value 1uF  [CERCAP 0402]
C15  value 1uF  [CERCAP 0402]
C16  value 10uF  [CERCAP 0603]
C17  value 2.2uF  [CERCAP 0603]
C18  value 0.1uF  [CERCAP 0402]
C19  value 1uF  [CERCAP 0402]
C20  value 47uF  [TECAP B]  (hidden comment: TAJC686K016RNJ)
C21  value 10uF  [CERCAP 0603]
C22  value 22pF  [CERCAP 0402]
C23  value 0.1uF  [CERCAP 0402]
C56  value 0.1uF  [CERCAP 0402]
L1  value 10uH 2A  [IND-4.6x4.6]
R16  value 10 Ohm  [RES 0402]
R17  value 2Ohm  [RES 0402]
R18  value 10k  [RES 0402]
R20  value 50 mOhm  [RES 1210]
R21  value 499k  [RES 0402]
R22  value 100k  [RES 0402]
R89  value 5.23k  [RES 0402]
R90  value 30.1k  [RES 0402]
R91  value 10k  [RES 0402]
U4  BQ24650RVAR  [QFN-16(3,5x3,5)]
VD1  (no value)  [SOD-123]
VD2  (no value)  [SOD-123]
VT4  NTMFS5C670NLT1G  [DFN-8_3x3]  (value not drawn)
VT5  NTMFS5C670NLT1G  [DFN-8_3x3]  (value not drawn)

### Sub-sheets
ShuntAmp = ShuntAmp.SchDoc: OUT (out), IN- (in), IN+ (in), VCC

### Ports
3V3_SYS, BAT, MPPT_I (out), SolarPanel

### Nets
3V3_SYS: port 3V3_SYS, sheet ShuntAmp/VCC
BAT_2S: C20.1(+) C21.2 C22.2 C23.2 C56.2 R20.2 R21.2 U4.9(SRN) ; port BAT, sheet ShuntAmp/IN-
GND: C14.1 C15.1 C16.2 C17.1 C19.2 C20.2(-) C21.1 C56.1 R22.1 R90.1 R91.1 U4.11(GND) U4.TH VT5.S1
CSP: C23.1 L1.2 R20.1 U4.10(SRP) ; sheet ShuntAmp/IN+
FB: C22.1 R21.1 R22.2 U4.8(VFB)
HDRV: U4.15(HIDRV) VT4.G2
LDRV: U4.13(LODRV) VT5.G2
MPPT_EN: R18.1 R91.2 U4.2(MPPSET)
MPPT_I: port MPPT_I, sheet ShuntAmp/OUT
MPPT_VIN: C16.1 R16.2 R18.2 VD1.C(Cathode) VT4.D6
PH: C18.1 L1.1 U4.14(PH) VT4.S1 VT5.D6
SP_IN: R17.2 VD1.A(Anode) ; port SolarPanel
VCC: C15.2 R16.1 U4.1(VCC)
VREF: C19.1 R89.2 U4.6(VREF) U4.7(TERM_EN)
NetC14_2: C14.2 U4.12(REGN) VD2.A(Anode)
NetC17_2: C17.2 R17.1
NetC18_2: C18.2 U4.16(BTST) VD2.C(Cathode)
NetR89_1: R89.1 R90.2 U4.4(TS)

Not connected (* = marked no-connect by the designer): U4 3(STAT1) 5(STAT2)

### Notes on the sheet
- (near VD1) 2A
- CSN
- (in symbol !Generic N MOSFET) D; G; S

### Library data of the parts
C14-C19 C21-C23 C56 = !Capacitor: as C82 on sheet Battery
C20 = CapacitorP: Capacitor Polar; IsSMT: NoSMT; Diel: X7R; Voltage: *
L1 = Inductor: IsSMT: NoSMT
R16-R18 R20-R22 R89-R91 = !Resistor: Resistor; IsSMT: NoSMT
U4 = BQ24650RVAR: MPPT charger
VD1 VD2 = DiodeS: Diode Shottky; IsSMT: NoSMT
VT4 VT5 = !Generic N MOSFET: generic N mosfet; pin to pad: D6>5+6+7+8+TH G2>4 S1>1+2+3; IsSMT: NoSMT

## Sheet ShuntAmp.SchDoc
size A4; SheetNumber: 10; SheetTotal: 21
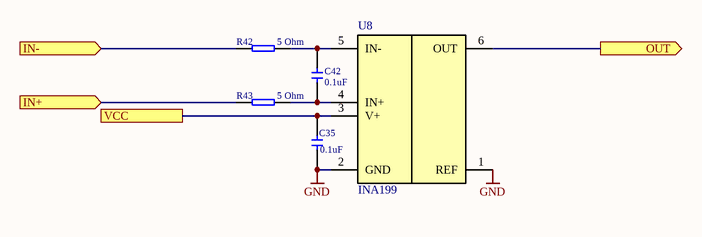
[diagram p8: ShuntAmp.SchDoc]

### Parts
C35  value 0.1uF  [CERCAP 0402]
C42  value 0.1uF  [CERCAP 0402]
R42  value 5 Ohm  [RES 0402]
R43  value 5 Ohm  [RES 0402]
U8  INA199  [SOT-323-6 (SC-70)]

### Ports
IN+ (in), IN- (in), OUT (out), VCC

### Nets
3V3_SYS: C35.2 U8.3(V+) ; port VCC
BAT_2S: R42.1 ; port IN-
GND: C35.1 U8.1(REF) U8.2(GND)
CSP: R43.1 ; port IN+
MPPT_I: U8.6(OUT) ; port OUT
NetC42_1: C42.1 R43.2 U8.4(IN+)
NetC42_2: C42.2 R42.2 U8.5(IN-)

### Library data of the parts
C35 C42 = !Capacitor: as C82 on sheet Battery
R42 R43 = !Resistor: Resistor; IsSMT: NoSMT
U8 = INA199: Current shunt monitor; IsSMT: NoSMT

## Sheet USB_Type-C.SchDoc
size A4; SheetNumber: 10; SheetTotal: 12
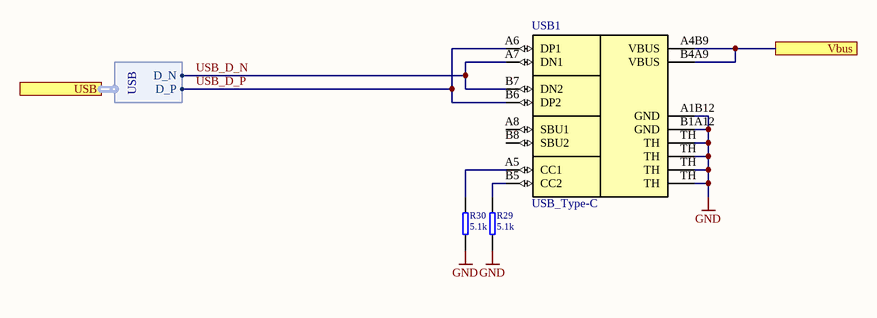
[diagram p9: USB_Type-C.SchDoc]

### Parts
R29  value 5.1k  [RES 0402]
R30  value 5.1k  [RES 0402]
USB1  USB_Type-C  [USB_Type-C]

### Ports
USB (harness USB), Vbus

### Harnesses
USB: D_N, D_P

### Nets
GND: R29.1 R30.1 USB1.A1B12(GND) USB1.B1A12(GND) USB1.TH
USB_D_N: USB1.A7(DN1) USB1.B7(DN2) ; port USB.D_N
USB_D_P: USB1.A6(DP1) USB1.B6(DP2) ; port USB.D_P
NetR29_2: R29.2 USB1.B5(CC2)
NetR30_2: R30.2 USB1.A5(CC1)
NetUSB1_A4B9: USB1.A4B9(VBUS) USB1.B4A9(VBUS) ; port Vbus

Not connected (* = marked no-connect by the designer): USB1 A8(SBU1) B8(SBU2)

### Library data of the parts
R29 R30 = !Resistor: Resistor; IsSMT: NoSMT
USB1 = USB_Type-C: USB Type-C connector

## Sheet Charger.SchDoc
size A4; SheetNumber: 12; SheetTotal: 21
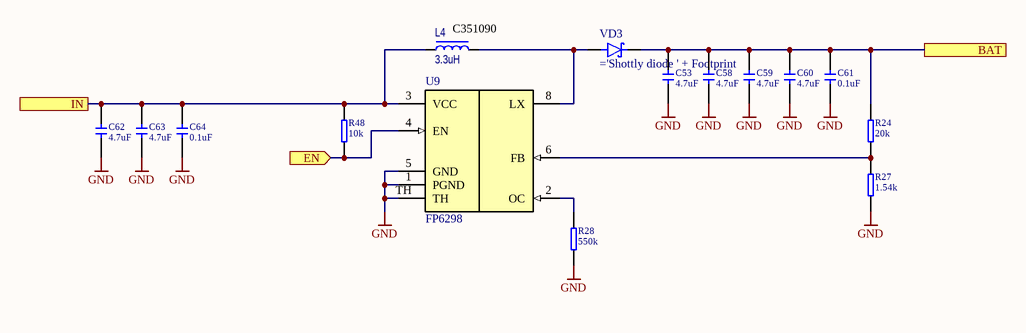
[diagram p10: Charger.SchDoc]

### Parts
C53  value 4.7uF  [CERCAP 0603]
C58  value 4.7uF  [CERCAP 0603]
C59  value 4.7uF  [CERCAP 0603]
C60  value 4.7uF  [CERCAP 0603]
C61  value 0.1uF  [CERCAP 0402]
C62  value 4.7uF  [CERCAP 0603]
C63  value 4.7uF  [CERCAP 0603]
C64  value 0.1uF  [CERCAP 0402]
L4  value 3.3uH  [IND-4.6x4.6]
R24  value 20k  [RES 0402]
R27  value 1.54k  [RES 0402]
R28  value 550k  [RES 0402]
R48  value 10k  [RES 0402]
U9  FP6298  [SO-8(EP)]
VD3  (no value)  [SOD-123]

### Ports
BAT, EN (in), IN

### Nets
BAT_2S: C53.2 C58.2 C59.2 C60.2 C61.2 R24.2 VD3.C(Cathode) ; port BAT
GND: C53.1 C58.1 C59.1 C60.1 C61.1 C62.1 C63.1 C64.1 R27.1 R28.1 U9.1(PGND) U9.5(GND) U9.TH
5V_CHARGE: C62.2 C63.2 C64.2 L4.1 R48.2 U9.3(VCC) ; port IN
NetL4_2: L4.2 U9.8(LX) VD3.A(Anode)
NetR24_1: R24.1 R27.2 U9.6(FB)
NetR28_2: R28.2 U9.2(OC)
NetR48_1: R48.1 U9.4(EN) ; port EN

### Notes on the sheet
- (near L4) C351090

### Library data of the parts
C53 C58-C60 = !Capacitor: as C25 on sheet DC-step-down
C61 C64 = !Capacitor: as C82 on sheet Battery
C62 C63 = !Capacitor: as C28 on sheet DC-step-down
L4 = Inductor: IsSMT: NoSMT
R24 R27 R28 R48 = !Resistor: Resistor; IsSMT: NoSMT
U9 = FP6298: boost not-synq wEN woPG wCL
VD3 = DiodeS: Diode Shottky; IsSMT: NoSMT

## Sheet MCU.SchDoc
size A4; SheetNumber: 5; SheetTotal: 9
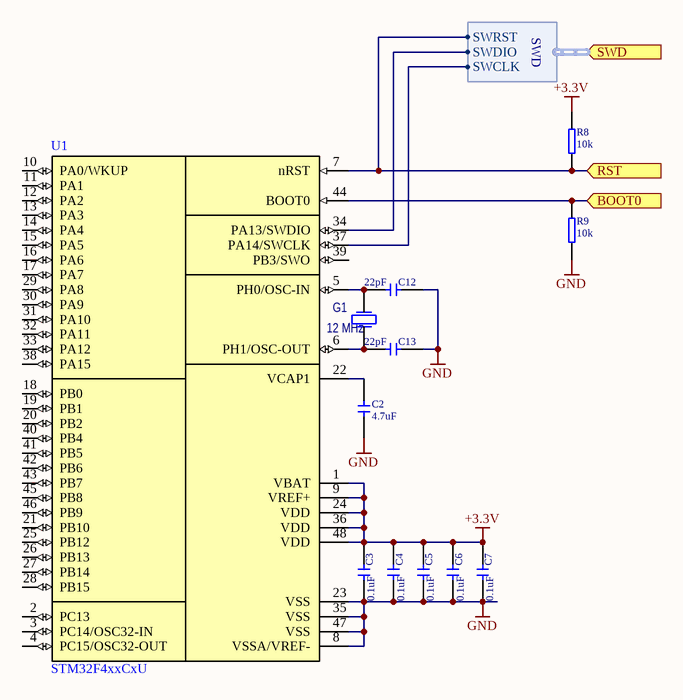
[diagram p11: MCU.SchDoc]

### Parts
C2  value 4.7uF  [CERCAP 0603]
C3  value 0.1uF  [CERCAP 0402]
C4  value 0.1uF  [CERCAP 0402]
C5  value 0.1uF  [CERCAP 0402]
C6  value 0.1uF  [CERCAP 0402]
C7  value 0.1uF  [CERCAP 0402]
C12  value 22pF  [CERCAP 0402]
C13  value 22pF  [CERCAP 0402]
G1  value 12 MHz  [3225]
R8  value 10k  [RES 0402]
R9  value 10k  [RES 0402]
U1  STM32F4xxCxU  [QFN-48]

### Ports
BOOT0 (in), RST (in), SWD (in, harness SWD)

### Harnesses
SWD: SWDIO, SWCLK, SWRST

### Nets
+3.3V: C3.2 C4.2 C5.2 C6.2 C7.2 R8.2 U1.1(VBAT) U1.9(VREF+) U1.24(VDD) U1.36(VDD) U1.48(VDD)
GND: C2.1 C3.1 C4.1 C5.1 C6.1 C7.1 C12.2 C13.2 R9.1 U1.8(VSSA/VREF-) U1.23(VSS) U1.35(VSS) U1.47(VSS)
BOOT0: R9.2 U1.44(BOOT0) ; port BOOT0
EPS_RST: R8.1 U1.7(nRST) ; port RST, port SWD.SWRST
NetC2_2: C2.2 U1.22(VCAP1)
NetC12_1: C12.1 G1.2 U1.5(PH0/OSC-IN)
NetC13_1: C13.1 G1.1 U1.6(PH1/OSC-OUT)
NetR85_2: U1.37(PA14/SWCLK) ; port SWD.SWCLK
NetR86_2: U1.34(PA13/SWDIO) ; port SWD.SWDIO

Not connected (* = marked no-connect by the designer): U1 2(PC13) 3(PC14/OSC32-IN) 4(PC15/OSC32-OUT) 10(PA0/WKUP) 11(PA1) 12(PA2) 13(PA3) 14(PA4) 15(PA5) 16(PA6) 17(PA7) 18(PB0) 19(PB1) 20(PB2) 21(PB10) 25(PB12) 26(PB13) 27(PB14) 28(PB15) 29(PA8) 30(PA9) 31(PA10) 32(PA11) 33(PA12) 38(PA15) 39(PB3/SWO) 40(PB4) 41(PB5) 42(PB6) 43(PB7) 45(PB8) 46(PB9)

### Library data of the parts
C2-C7 C12 C13 = !Capacitor: Capacitor; IsSMT: NoSMT; Diel: X7R; Voltage: *
G1 = Crystal: pin to pad: 2>3; IsSMT: NoSMT
R8 R9 = !Resistor: Resistor; IsSMT: NoSMT
U1 = STM32F4xxCxU: Cortex-M4

## Sheet Connectors.SchDoc
size A4; SheetNumber: 13; SheetTotal: 21
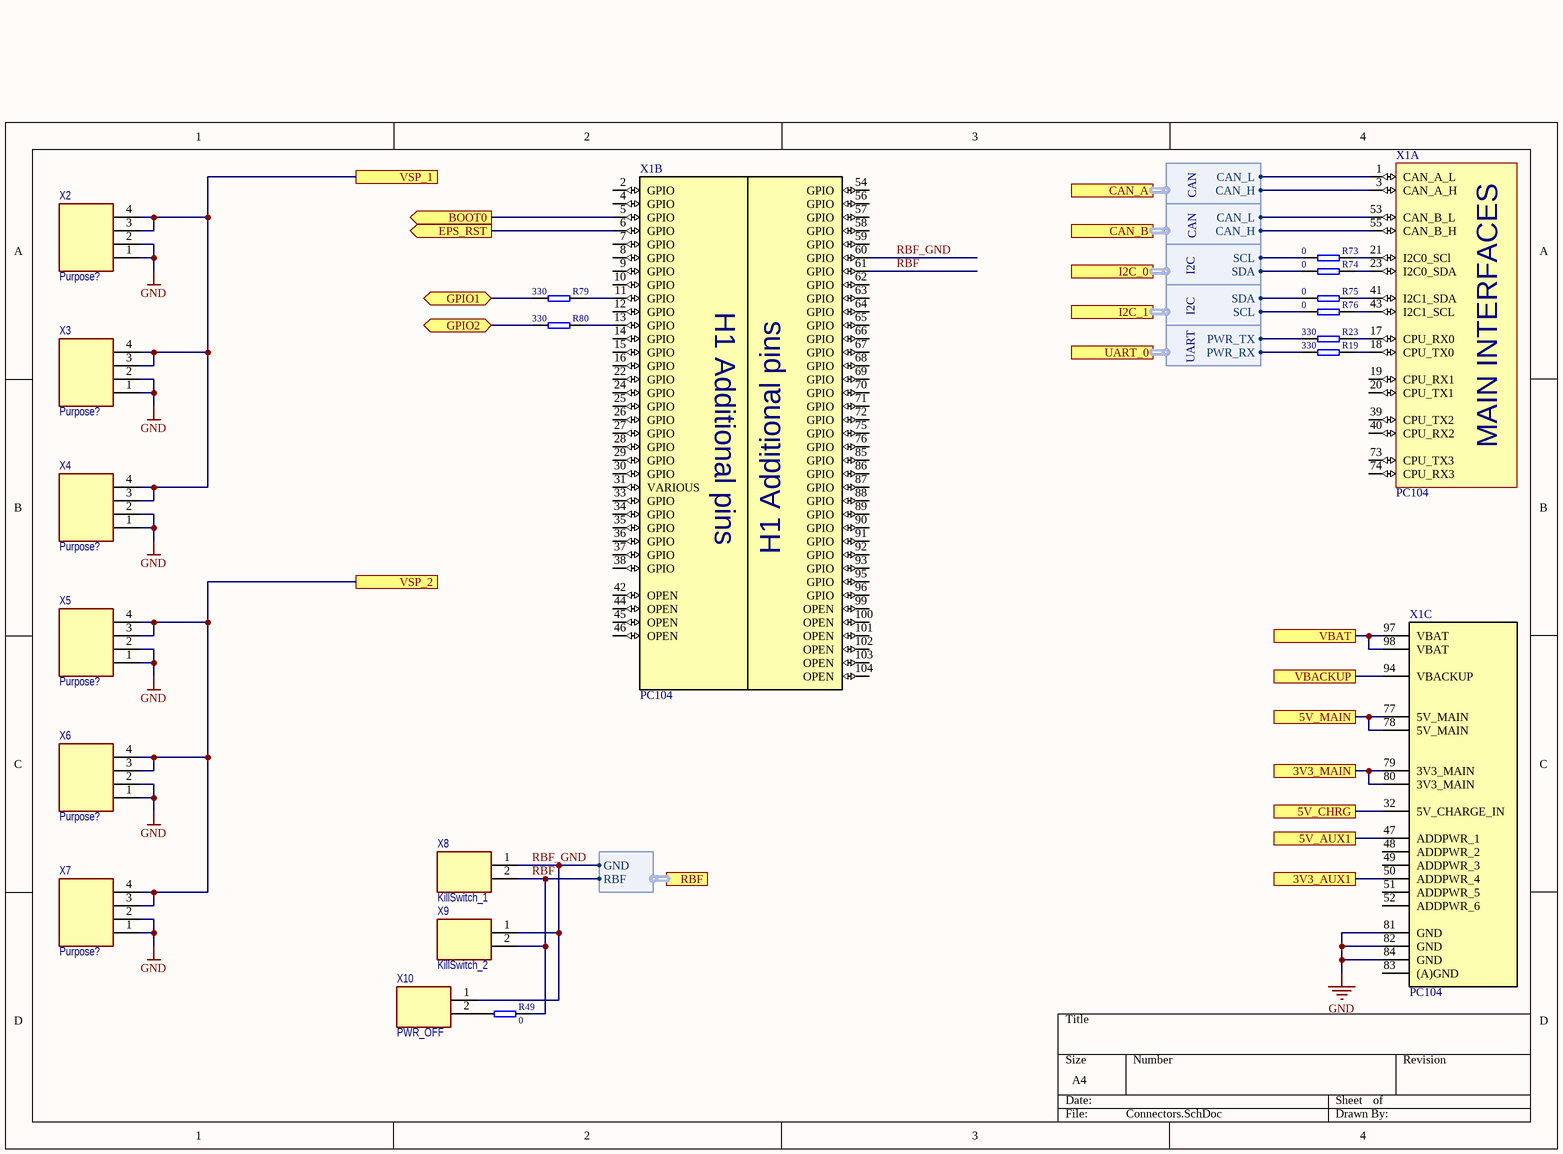
[diagram p12: Connectors.SchDoc]

### Parts
R19  value 330  [RES 0402]
R23  value 330  [RES 0402]
R49  value 0  [RES 0402]
R73  value 0  [RES 0402]
R74  value 0  [RES 0402]
R75  value 0  [RES 0402]
R76  value 0  [RES 0402]
R79  value 330  [RES 0402]
R80  value 330  [RES 0402]
X1  PC104  [PC104_ArianSpace]  (parts A,B,C of 3)
X2  Purpose: Purpose?  [PicoBlade_4P]  (hidden comment: 0533980471)
X3  Purpose: Purpose?  [PicoBlade_4P]  (hidden comment: 0533980471)
X4  Purpose: Purpose?  [PicoBlade_4P]  (hidden comment: 0533980471)
X5  Purpose: Purpose?  [PicoBlade_4P]  (hidden comment: 0533980471)
X6  Purpose: Purpose?  [PicoBlade_4P]  (hidden comment: 0533980471)
X7  Purpose: Purpose?  [PicoBlade_4P]  (hidden comment: 0533980471)
X8  Purpose: KillSwitch_1  [PicoBlade_2P]  (hidden comment: 0533980271)
X9  Purpose: KillSwitch_2  [PicoBlade_2P]  (hidden comment: 0533980271)
X10  Purpose: PWR_OFF  [PLS-2R-2.54]  (hidden comment: PLS-2R)

### Ports
3V3_AUX1, 3V3_MAIN, 5V_AUX1, 5V_CHRG, 5V_MAIN, BOOT0 (out), CAN_A (harness CAN), CAN_B (harness CAN), EPS_RST (out), GPIO1 (bidir), GPIO2 (bidir), I2C_0 (harness I2C), I2C_1 (harness I2C), RBF (harness RBF), UART_0 (harness UART), VBACKUP, VBAT, VSP_1, VSP_2

### Harnesses
CAN: CAN_H, CAN_L
I2C: SDA, SCL
UART: PWR_RX, PWR_TX
RBF: GND, RBF

### Nets
GND: X1.81(GND) X1.82(GND) X1.84(GND) X2.1 X2.2 X3.1 X3.2 X4.1 X4.2 X5.1 X5.2 X6.1 X6.2 X7.1 X7.2
3V3_AUX1: X1.50(ADDPWR_4) ; port 3V3_AUX1
3V3_MAIN: X1.79(3V3_MAIN) X1.80(3V3_MAIN) ; port 3V3_MAIN
5V_AUX1: X1.47(ADDPWR_1) ; port 5V_AUX1
5V_CHARGE: X1.32(5V_CHARGE_IN) ; port 5V_CHRG
5V_MAIN: X1.77(5V_MAIN) X1.78(5V_MAIN) ; port 5V_MAIN
BOOT0: X1.5(GPIO) ; port BOOT0
CAN_H: X1.3(CAN_A_H) ; port CAN_A.CAN_H
CAN_H: X1.55(CAN_B_H) ; port CAN_B.CAN_H  [a separate net that carries the same name]
CAN_L: X1.1(CAN_A_L) ; port CAN_A.CAN_L
CAN_L: X1.53(CAN_B_L) ; port CAN_B.CAN_L  [a separate net that carries the same name]
EPS_RST: X1.6(GPIO) ; port EPS_RST
GPIO1: R79.1 ; port GPIO1
GPIO2: R80.1 ; port GPIO2
RBF: R49.2 X1.61(GPIO) X8.2 X9.2 ; port RBF.RBF
RBF_GND: X1.60(GPIO) X8.1 X9.1 X10.1 ; port RBF.GND
SP_IN: X2.3 X2.4 X3.3 X3.4 X4.3 X4.4 X5.3 X5.4 X6.3 X6.4 X7.3 X7.4 ; port VSP_1, port VSP_2
VBACKUP: X1.94(VBACKUP) ; port VBACKUP
VBAT_PC104: X1.97(VBAT) X1.98(VBAT) ; port VBAT
NetR19_1: R19.1 ; port UART_0.PWR_RX
NetR19_2: R19.2 X1.18(CPU_TX0)
NetR23_1: R23.1 ; port UART_0.PWR_TX
NetR23_2: R23.2 X1.17(CPU_RX0)
NetR49_1: R49.1 X10.2
NetR73_1: R73.1 ; port I2C_0.SCL
NetR73_2: R73.2 X1.21(I2C0_SCl)
NetR74_1: R74.1 ; port I2C_0.SDA
NetR74_2: R74.2 X1.23(I2C0_SDA)
NetR75_1: R75.1 ; port I2C_1.SDA
NetR75_2: R75.2 X1.41(I2C1_SDA)
NetR76_1: R76.1 ; port I2C_1.SCL
NetR76_2: R76.2 X1.43(I2C1_SCL)
NetR79_2: R79.2 X1.11(GPIO)
NetR80_2: R80.2 X1.13(GPIO)

Not connected (* = marked no-connect by the designer): X1 2(GPIO) 4(GPIO) 7(GPIO) 8(GPIO) 9(GPIO) 10(GPIO) 12(GPIO) 14(GPIO) 15(GPIO) 16(GPIO) 19(CPU_RX1) 20(CPU_TX1) 22(GPIO) 24(GPIO) 25(GPIO) 26(GPIO) 27(GPIO) 28(GPIO) 29(GPIO) 30(GPIO) 31(VARIOUS) 33(GPIO) 34(GPIO) 35(GPIO) 36(GPIO) 37(GPIO) 38(GPIO) 39(CPU_TX2) 40(CPU_RX2) 42(OPEN) 44(OPEN) 45(OPEN) 46(OPEN) 48(ADDPWR_2) 49(ADDPWR_3) 51(ADDPWR_5) 52(ADDPWR_6) 54(GPIO) 56(GPIO) 57(GPIO) 58(GPIO) 59(GPIO) 62(GPIO) 63(GPIO) 64(GPIO) 65(GPIO) 66(GPIO) 67(GPIO) 68(GPIO) 69(GPIO) 70(GPIO) 71(GPIO) 72(GPIO) 73(CPU_TX3) 74(CPU_RX3) 75(GPIO) 76(GPIO) 83((A)GND) 85(GPIO) 86(GPIO) 87(GPIO) 88(GPIO) 89(GPIO) 90(GPIO) 91(GPIO) 92(GPIO) 93(GPIO) 95(GPIO) 96(GPIO) 99(OPEN) 100(OPEN) 101(OPEN) 102(OPEN) 103(OPEN) 104(OPEN)

### Notes on the sheet
- (in symbol PC104_ArianSpace, part A) MAIN INTERFACES
- (in symbol PC104_ArianSpace, part B) H1 Additional pins

### Library data of the parts
R19 R23 R49 R73-R76 R79 R80 = !Resistor: Resistor; IsSMT: NoSMT
X1 = PC104_ArianSpace: PC104 connector
X2-X7 = Header 1x4: 4x1 header; IsSMT: NoSMT
X8-X10 = Header 1x2: 2x1 header; isSMT: NoSMT

## Sheet CAN_PHY.SchDoc
size A4; SheetNumber: 14; SheetTotal: 21
Used 2 times, as channels CAN_PHY, CAN_PHY. Parts and nets are listed once, with the designators drawn on the sheet.
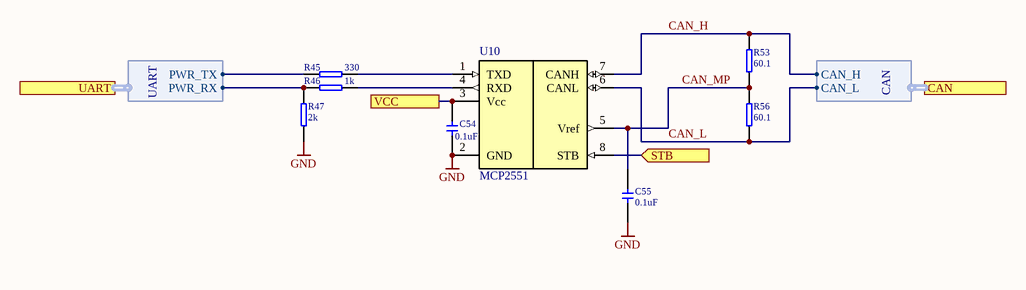
[diagram p13: CAN_PHY.SchDoc]

### Parts
C54  value 0.1uF  [CERCAP 0402]
C55  value 0.1uF  [CERCAP 0402]
R45  value 330  [RES 0402]
R46  value 1k  [RES 0402]
R47  value 2k  [RES 0402]
R53  value 60.1  [RES 0402]
R56  value 60.1  [RES 0402]
U10  MCP2551  [SO-8]

### Ports
CAN (harness CAN), STB (in), UART (harness UART), VCC

### Harnesses
CAN: CAN_H, CAN_L
UART: PWR_RX, PWR_TX

### Nets
GND: C54.1 C55.1 R47.1 U10.2(GND)
CAN_H: R53.2 U10.7(CANH) ; port CAN.CAN_H
CAN_L: R56.1 U10.6(CANL) ; port CAN.CAN_L
CAN_MP: C55.2 R53.1 R56.2 U10.5(Vref)
STB: U10.8(STB) ; port STB
VCC: C54.2 U10.3(Vcc) ; port VCC
NetR45_1: R45.1 ; port UART.PWR_TX
NetR45_2: R45.2 U10.1(TXD)
NetR46_1: R46.1 R47.2 ; port UART.PWR_RX
NetR46_2: R46.2 U10.4(RXD)

### Channels
CAN_PHY: designators end in _CAN_PHY#1; ports STB=NetR88_1 VCC=5V_SYS
CAN_PHY: designators end in _CAN_PHY#2; ports STB=NetR88_1 VCC=5V_SYS

### Library data of the parts
C54 C55 = !Capacitor: as C82 on sheet Battery
R45-R47 R53 R56 = !Resistor: Resistor; IsSMT: NoSMT
U10 = CAN_PHY: CAN PHY

## Sheet V_SYS_Regulator.SchDoc
size A4; SheetNumber: 15; SheetTotal: 21
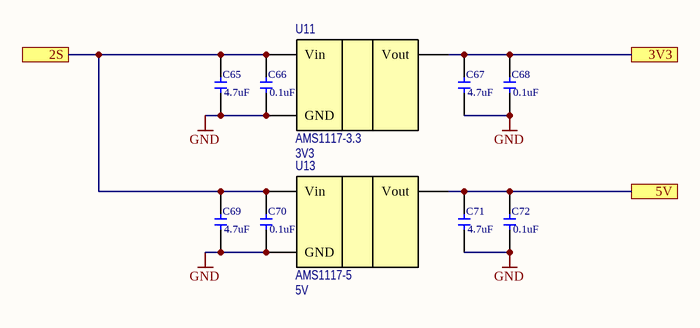
[diagram p14: V_SYS_Regulator.SchDoc]

### Parts
C65  value 4.7uF  [CERCAP 0603]
C66  value 0.1uF  [CERCAP 0402]
C67  value 4.7uF  [CERCAP 0603]
C68  value 0.1uF  [CERCAP 0402]
C69  value 4.7uF  [CERCAP 0603]
C70  value 0.1uF  [CERCAP 0402]
C71  value 4.7uF  [CERCAP 0603]
C72  value 0.1uF  [CERCAP 0402]
U11  AMS1117-3.3  value 3V3  [SOT223]
U13  AMS1117-5  value 5V  [SOT223]

### Ports
2S, 3V3, 5V

### Nets
3V3_SYS: C67.2 C68.2 U11.Vout ; port 3V3
5V_SYS: C71.2 C72.2 U13.Vout ; port 5V
BAT_2S: C65.2 C66.2 C69.2 C70.2 U11.Vin U13.Vin ; port 2S
GND: C65.1 C66.1 C67.1 C68.1 C69.1 C70.1 C71.1 C72.1 U11.ADJ/GND(GND) U13.ADJ/GND(GND)

### Library data of the parts
C65 C67 C69 C71 = !Capacitor: as C25 on sheet DC-step-down
C66 C68 C70 C72 = !Capacitor: as C82 on sheet Battery
U11 U13 = !Generic LDO: generic ldo; pin to pad: ADJ/GND>1 Vin>3 Vout>2; IsSMT: NoSMT

## Sheet Vbat_key.SchDoc
size A4; SheetNumber: 16; SheetTotal: 21
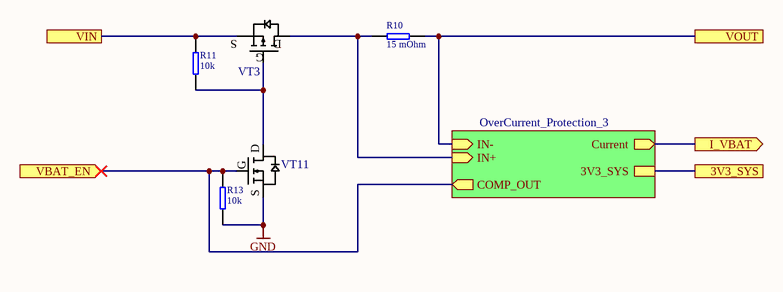
[diagram p15: Vbat_key.SchDoc]

### Parts
R10  value 15 mOhm  [RES 1210]
R11  value 10k  [RES 0402]
R13  value 10k  [RES 0402]
VT3  !Generic P MOSFET  [DFN-8_3x3]  (value not drawn)
VT11  2N7002  [SOT23-3]  (value not drawn)

### Sub-sheets
OverCurrent_Protection_3 = OverCurrent_Protection.SchDoc: IN- (in), IN+ (in), Current (out), COMP_OUT (out), 3V3_SYS

### Ports
3V3_SYS, I_VBAT (out), VBAT_EN (in), VIN, VOUT

### Nets
3V3_SYS: port 3V3_SYS, sheet OverCurrent_Protection_3/3V3_SYS
BAT_2S: R11.2 VT3.S1 ; port VIN
GND: R13.1 VT11.S1
I_VBAT: port I_VBAT, sheet OverCurrent_Protection_3/Current
VBAT_EN: R13.2 VT11.G2 ; port VBAT_EN, sheet OverCurrent_Protection_3/COMP_OUT
VBAT_PC104: R10.2 ; port VOUT, sheet OverCurrent_Protection_3/IN-
NetR10_1: R10.1 VT3.D1 ; sheet OverCurrent_Protection_3/IN+
NetR11_1: R11.1 VT3.G2 VT11.D6

### Notes on the sheet
- (in symbol !Generic N MOSFET) D; G; S
- (in symbol !Generic P MOSFET) S; D; G

### Library data of the parts
R10 R11 R13 = !Resistor: Resistor; IsSMT: NoSMT
VT3 = !Generic P MOSFET: generic P mosfet; pin to pad: D1>5+6+7+8+TH G2>4 S1>1+2+3; IsSMT: NoSMT
VT11 = !Generic N MOSFET: generic N mosfet; pin to pad: D6>3 G2>1 S1>2; IsSMT: NoSMT

## Sheet AuxChannels.SchDoc
size A4; SheetNumber: 17; SheetTotal: 17
Used 2 times, as channels AuxChannels, AuxChannels. Parts and nets are listed once, with the designators drawn on the sheet.
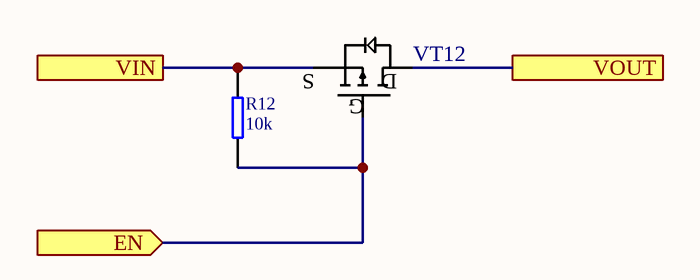
[diagram p16: AuxChannels.SchDoc]

### Parts
R12  value 10k  [RES 0402]
VT12  !Generic P MOSFET  [DFN-8_3x3]  (value not drawn)

### Ports
EN (in), VIN, VOUT

### Nets
EN: R12.1 VT12.G2 ; port EN
VIN: R12.2 VT12.S1 ; port VIN
VOUT: VT12.D1 ; port VOUT

### Channels
AuxChannels: designators end in _AuxChannels#1; ports EN=3V3_AUX1_EN VIN=3V3_MAIN VOUT=3V3_AUX1
AuxChannels: designators end in _AuxChannels#2; ports EN=5V_AUX1_EN VIN=5V_MAIN VOUT=5V_AUX1

### Notes on the sheet
- (in symbol !Generic P MOSFET) S; D; G

### Library data of the parts
R12 = !Resistor: Resistor; IsSMT: NoSMT
VT12 = !Generic P MOSFET: generic P mosfet; pin to pad: D1>5+6+7+8+TH G2>4 S1>1+2+3; IsSMT: NoSMT

## Sheet V_BACKUP.SchDoc
size A4; SheetNumber: 18; SheetTotal: 21
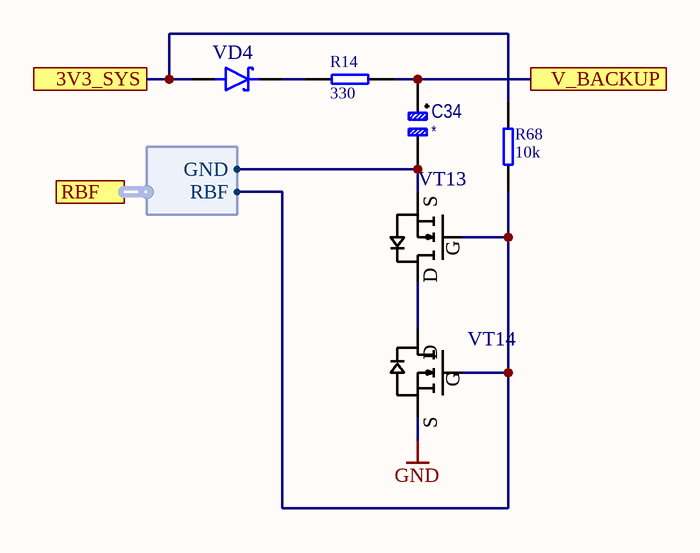
[diagram p17: V_BACKUP.SchDoc]

### Parts
C34  *  [DCS5R5224H]
R14  value 330  [RES 0402]
R68  value 10k  [RES 0402]
VD4  (no value)  [SOD-123]
VT13  2N7002  [SOT23-3]  (value not drawn)
VT14  2N7002  [SOT23-3]  (value not drawn)

### Ports
3V3_SYS, RBF (harness RBF), V_BACKUP

### Harnesses
RBF: GND, RBF

### Nets
3V3_SYS: R68.2 VD4.A(Anode) ; port 3V3_SYS
GND: VT14.S1
RBF: R68.1 VT13.G2 VT14.G2 ; port RBF.RBF
RBF_GND: C34.2(-) VT13.S1 ; port RBF.GND
VBACKUP: C34.1(+) R14.2 ; port V_BACKUP
NetR14_1: R14.1 VD4.C(Cathode)
NetVT13_D6: VT13.D6 VT14.D6

### Notes on the sheet
- (in symbol !Generic N MOSFET) D; G; S

### Library data of the parts
C34 = Ionistor: Super Capacitor; IsSMT: NoSMT; Order: *; LCSC Part #: *; BuyLink1: *; Value: *
R14 R68 = !Resistor: Resistor; IsSMT: NoSMT
VD4 = DiodeS: Diode Shottky; IsSMT: NoSMT
VT13 VT14 = !Generic N MOSFET: generic N mosfet; pin to pad: D6>3 G2>1 S1>2; IsSMT: NoSMT

## Sheet DS18B20.SchDoc
size A4; SheetNumber: 19; SheetTotal: 21
Used 2 times, as channels DS18B20, DS18B21. Parts and nets are listed once, with the designators drawn on the sheet.
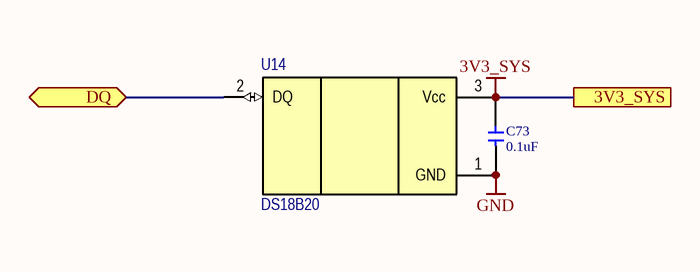
[diagram p18: DS18B20.SchDoc]

### Parts
C73  value 0.1uF  [CERCAP 0402]
U14  DS18B20  [TO-92]

### Ports
3V3_SYS, DQ (bidir)

### Nets
3V3_SYS: C73.2 U14.3(Vcc) ; port 3V3_SYS
GND: C73.1 U14.1(GND)
DQ: U14.2(DQ) ; port DQ

### Channels
DS18B20: designators end in _DS18B20; ports 3V3_SYS=3V3_SYS DQ=DS18_DQ
DS18B21: designators end in _DS18B21; ports 3V3_SYS=3V3_SYS DQ=DS18_DQ

### Library data of the parts
C73 = !Capacitor: as C82 on sheet Battery
U14 = DS18B20: Temp; IsSMT: NoSMT

## Sheet BootDriver.SchDoc
size A4; SheetNumber: 20; SheetTotal: 21
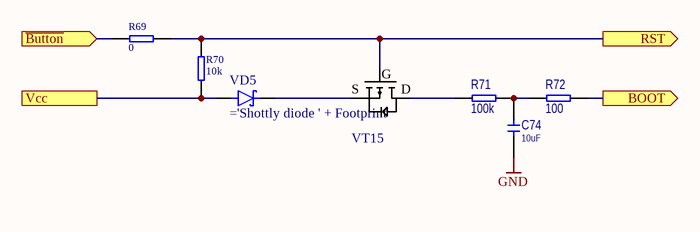
[diagram p19: BootDriver.SchDoc]

### Parts
C74  value 10uF  [CERCAP 0603]
R69  value 0  [RES 0402]
R70  value 10k  [RES 0402]
R71  value 100k  [RES 0402]
R72  value 100  [RES 0402]
VD5  (no value)  [SOD-123]
VT15  AO3407A  [SOT23-3]  (value not drawn)

### Ports
BOOT (out), RST (out), Vcc, ~{Button} (in)

### Nets
3V3_SYS: R70.1 VD5.A(Anode) ; port Vcc
GND: C74.1
BOOT0: R72.2 ; port BOOT
EPS_RST: R69.2 R70.2 VT15.G2 ; port RST
NetB1_2: R69.1 ; port ~{Button}
NetC74_2: C74.2 R71.2 R72.1
NetR71_1: R71.1 VT15.D1
NetVD5_C: VD5.C(Cathode) VT15.S1

### Notes on the sheet
- (in symbol !Generic P MOSFET) G; S; D

### Library data of the parts
C74 = !Capacitor: as C82 on sheet Battery
R69-R72 = !Resistor: Resistor; IsSMT: NoSMT
VD5 = DiodeS: Diode Shottky; IsSMT: NoSMT
VT15 = !Generic P MOSFET: generic P mosfet; pin to pad: D1>3 G2>1 S1>2; IsSMT: NoSMT

## Sheet Debugger.SchDoc
size A4; SheetNumber: 21; SheetTotal: 21
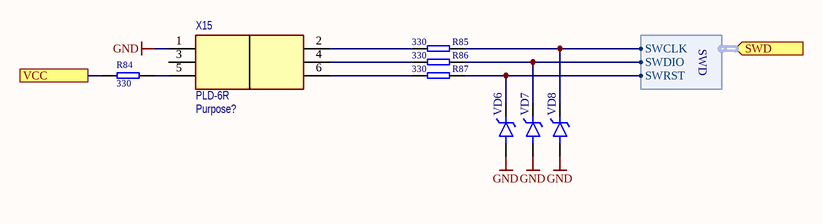
[diagram p20: Debugger.SchDoc]

### Parts
R84  value 330  [RES 0402]  (no BOM)
R85  value 330  [RES 0402]
R86  value 330  [RES 0402]
R87  value 330  [RES 0402]
VD6  DiodeTVSs  [SOD-323]  (value not drawn)
VD7  DiodeTVSs  [SOD-323]  (value not drawn)
VD8  DiodeTVSs  [SOD-323]  (value not drawn)
X15  PLD-6R  Purpose: Purpose?  [PBD-6-2.54]

### Ports
SWD (in, harness SWD), VCC

### Harnesses
SWD: SWDIO, SWCLK, SWRST

### Nets
3V3_SYS: R84.2 ; port VCC
GND: VD6.A(Anode) VD7.A(Anode) VD8.A(Anode) X15.1
EPS_RST: R87.2 VD6.C(Cathode) ; port SWD.SWRST
NetR84_1: R84.1 X15.5
NetR85_1: R85.1 X15.2
NetR85_2: R85.2 VD8.C(Cathode) ; port SWD.SWCLK
NetR86_1: R86.1 X15.4
NetR86_2: R86.2 VD7.C(Cathode) ; port SWD.SWDIO
NetR87_1: R87.1 X15.6

Not connected (* = marked no-connect by the designer): X15 3

### Library data of the parts
R84-R87 = !Resistor: Resistor; IsSMT: NoSMT
VD6-VD8 = DiodeTVSs: Diode TVS Single; IsSMT: NoSMT; Order: *; BuyLink1: *; LCSC Part #: *
X15 = Header 2x3: 3x2 header; IsSMT: NoSMT

## Nets that join several sheets
3V3_SYS: Battery (X11.4 X12.4 X13.4 X14.4), Step-Down/OverCurrent_Protection_1 (5 pins), Step-Down/OverCurrent_Protection_2 (5 pins), ShuntAmp (C35.2 U8.3), V_SYS_Regulator (C67.2 C68.2 U11.Vout), Vbat_key/OverCurrent_Protection_3 (5 pins), V_BACKUP (R68.2 VD4.A), DS18B20 (C73_DS18B20.2 U14_DS18B20.3), DS18B21 (C73_DS18B21.2 U14_DS18B21.3), BootDriver (R70.1 VD5.A), Debugger (R84.2)
5V_SYS: CAN_PHY (C54_CAN_PHY#1.2 U10_CAN_PHY#1.3), CAN_PHY (C54_CAN_PHY#2.2 U10_CAN_PHY#2.3), V_SYS_Regulator (C71.2 C72.2 U13.Vout)
BAT_2S: Battery (8 pins), Battery/Balancer (R4_Battery_Balancer#1.1 R6_Battery_Balancer#1.2), Battery/BAT2 (BAT1_BAT2.A R2_BAT2.2), Battery/BAT1 (BAT1_BAT1.A R2_BAT1.2), Battery/Balancer (R4_Battery_Balancer#2.1 R6_Battery_Balancer#2.2), Timer (5 pins), DC-step-down (8 pins), MPPT (8 pins), ShuntAmp (R42.1), Charger (7 pins), V_SYS_Regulator (6 pins), Vbat_key (R11.2 VT3.S1)
GND: EPS_V1 (6 pins), Battery (16 pins), Battery/Balancer (5 pins), Battery/Balancer (5 pins), Timer (5 pins), DC-step-down (38 pins), Step-Down/OverCurrent_Protection_1 (6 pins), Step-Down/OverCurrent_Protection_2 (6 pins), MPPT (14 pins), ShuntAmp (C35.1 U8.1 U8.2), USB_Type-C (5 pins), Charger (13 pins), MCU (13 pins), Connectors (15 pins), CAN_PHY (C54_CAN_PHY#1.1 C55_CAN_PHY#1.1 R47_CAN_PHY#1.1 U10_CAN_PHY#1.2), CAN_PHY (C54_CAN_PHY#2.1 C55_CAN_PHY#2.1 R47_CAN_PHY#2.1 U10_CAN_PHY#2.2), V_SYS_Regulator (10 pins), Vbat_key (R13.1 VT11.S1), Vbat_key/OverCurrent_Protection_3 (6 pins), V_BACKUP (VT14.S1), DS18B20 (C73_DS18B20.1 U14_DS18B20.1), DS18B21 (C73_DS18B21.1 U14_DS18B21.1), BootDriver (C74.1), Debugger (VD6.A VD7.A VD8.A X15.1)
3V3_AUX1: Connectors (X1.50), AuxChannels (VT12_AuxChannels#1.D1)
3V3_EN: DC-step-down (U5.8), Step-Down/OverCurrent_Protection_1 (R58_OverCurrent_Protection_1.1 VT7_OverCurrent_Protection_1.D6)
3V3_MAIN: DC-step-down (5 pins), Step-Down/OverCurrent_Protection_1 (U7_OverCurrent_Protection_1.5), Connectors (X1.79 X1.80), AuxChannels (R12_AuxChannels#1.2 VT12_AuxChannels#1.S1)
5V_AUX1: Connectors (X1.47), AuxChannels (VT12_AuxChannels#2.D1)
5V_CHARGE: EPS_V1 (VD9.C), Charger (6 pins), Connectors (X1.32)
5V_EN: DC-step-down (U6.8), Step-Down/OverCurrent_Protection_2 (R58_OverCurrent_Protection_2.1 VT7_OverCurrent_Protection_2.D6)
5V_MAIN: DC-step-down (5 pins), Step-Down/OverCurrent_Protection_2 (U7_OverCurrent_Protection_2.5), Connectors (X1.77 X1.78), AuxChannels (R12_AuxChannels#2.2 VT12_AuxChannels#2.S1)
BOOT0: MCU (R9.2 U1.44), Connectors (X1.5), BootDriver (R72.2)
CAN_H: Connectors (X1.3), CAN_PHY (R53_CAN_PHY#1.2 U10_CAN_PHY#1.7)
CAN_H: Connectors (X1.55), CAN_PHY (R53_CAN_PHY#2.2 U10_CAN_PHY#2.7)
CAN_L: Connectors (X1.1), CAN_PHY (R56_CAN_PHY#1.1 U10_CAN_PHY#1.6)
CAN_L: Connectors (X1.53), CAN_PHY (R56_CAN_PHY#2.1 U10_CAN_PHY#2.6)
CB_EN: Battery/Balancer (U3_Battery_Balancer#1.6), Battery/Balancer (U3_Battery_Balancer#2.6), Timer (R81.1 VT16.D6)
CSP: MPPT (C23.1 L1.2 R20.1 U4.10), ShuntAmp (R43.1)
DS18_DQ: DS18B20 (U14_DS18B20.2), DS18B21 (U14_DS18B21.2)
EPS_RST: MCU (R8.1 U1.7), Connectors (X1.6), BootDriver (R69.2 R70.2 VT15.G2), Debugger (R87.2 VD6.C)
NetB1_2: EPS_V1 (B1.2), BootDriver (R69.1)
NetBAT1_BAT3_A: Battery/Balancer (R5_Battery_Balancer#1.1 R7_Battery_Balancer#1.1), Battery/BAT3 (BAT1_BAT3.A R2_BAT3.2), Battery/BAT1 (R3_BAT1.1 U2_BAT1.6)
NetBAT1_BAT4_A: Battery/BAT2 (R3_BAT2.1 U2_BAT2.6), Battery/BAT4 (BAT1_BAT4.A R2_BAT4.2), Battery/Balancer (R5_Battery_Balancer#2.1 R7_Battery_Balancer#2.1)
NetC28_2: DC-step-down (7 pins), Step-Down/OverCurrent_Protection_1 (U7_OverCurrent_Protection_1.3)
NetC31_1: DC-step-down (7 pins), Step-Down/OverCurrent_Protection_2 (U7_OverCurrent_Protection_2.3)
NetR10_1: Vbat_key (R10.1 VT3.D1), Vbat_key/OverCurrent_Protection_3 (U7_OverCurrent_Protection_3.3)
NetR85_2: MCU (U1.37), Debugger (R85.2 VD8.C)
NetR86_2: MCU (U1.34), Debugger (R86.2 VD7.C)
NetR88_1: EPS_V1 (R88.1), CAN_PHY (U10_CAN_PHY#1.8), CAN_PHY (U10_CAN_PHY#2.8)
NetUSB1_A4B9: EPS_V1 (VD9.A), USB_Type-C (USB1.A4B9 USB1.B4A9)
RBF: Battery (R1.1 VT1.G2 VT2.G2), Connectors (R49.2 X1.61 X8.2 X9.2), V_BACKUP (R68.1 VT13.G2 VT14.G2)
RBF_GND: Battery (R15.1), Battery/BAT3 (R3_BAT3.1 U2_BAT3.6), Battery/BAT4 (R3_BAT4.1 U2_BAT4.6), Connectors (X1.60 X8.1 X9.1 X10.1), V_BACKUP (C34.2 VT13.S1)
SP_IN: MPPT (R17.2 VD1.A), Connectors (12 pins)
VBACKUP: Connectors (X1.94), V_BACKUP (C34.1 R14.2)
VBAT_EN: Vbat_key (R13.2 VT11.G2), Vbat_key/OverCurrent_Protection_3 (R58_OverCurrent_Protection_3.1 VT7_OverCurrent_Protection_3.D6)
VBAT_PC104: Connectors (X1.97 X1.98), Vbat_key (R10.2), Vbat_key/OverCurrent_Protection_3 (U7_OverCurrent_Protection_3.5)